# EAGLE board A20-OLinuXino-Lime_Rev_H (EAGLE 4.16), part 1 of 5
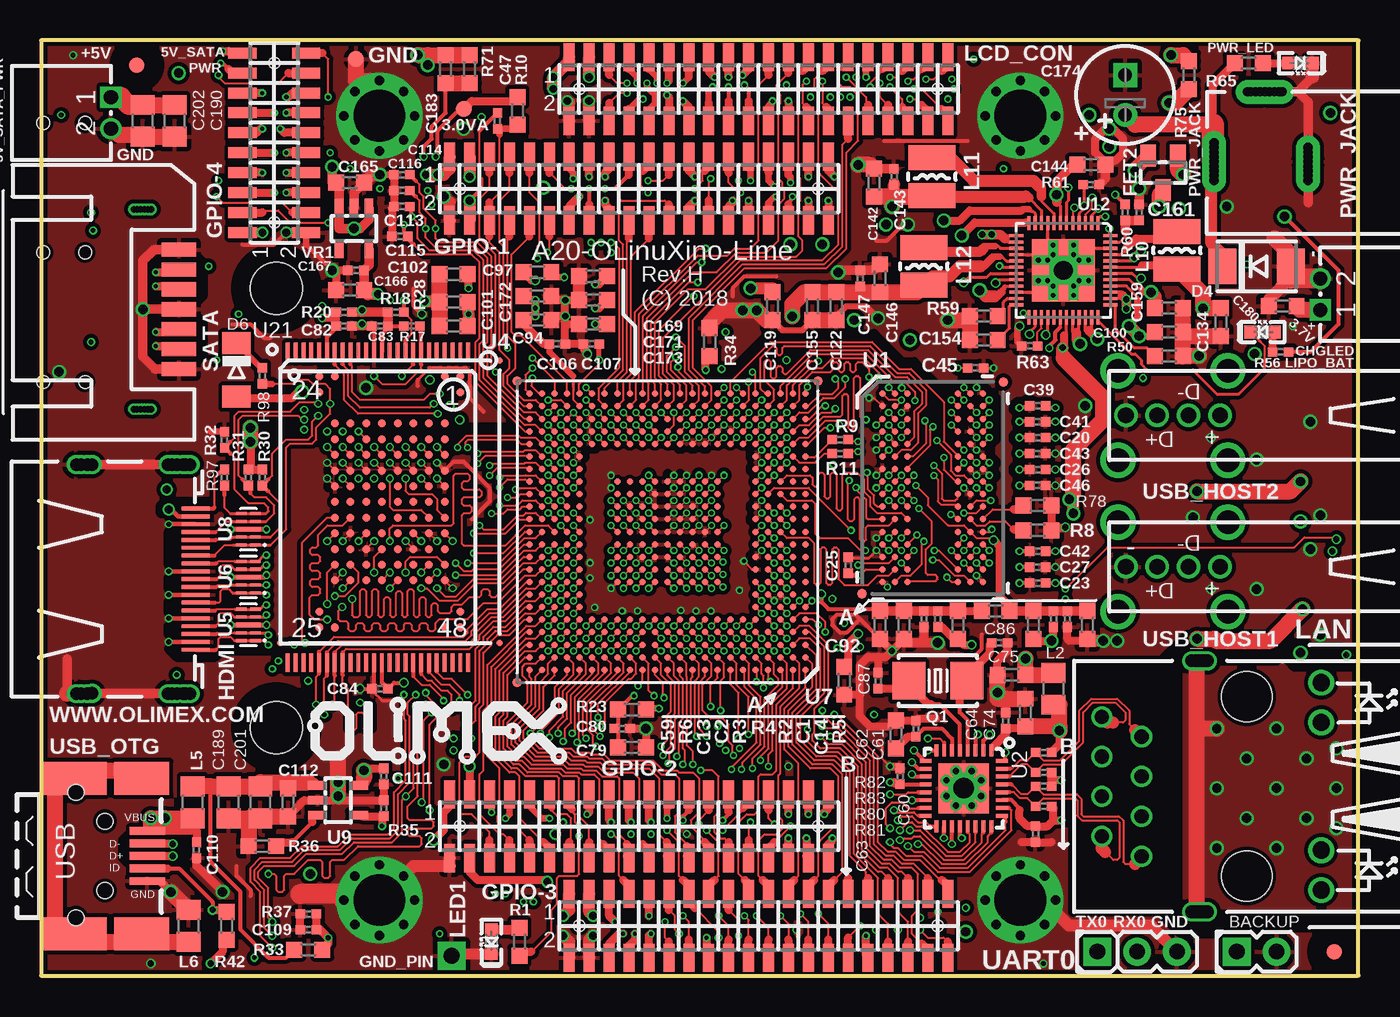
[diagram p5: board, top side]
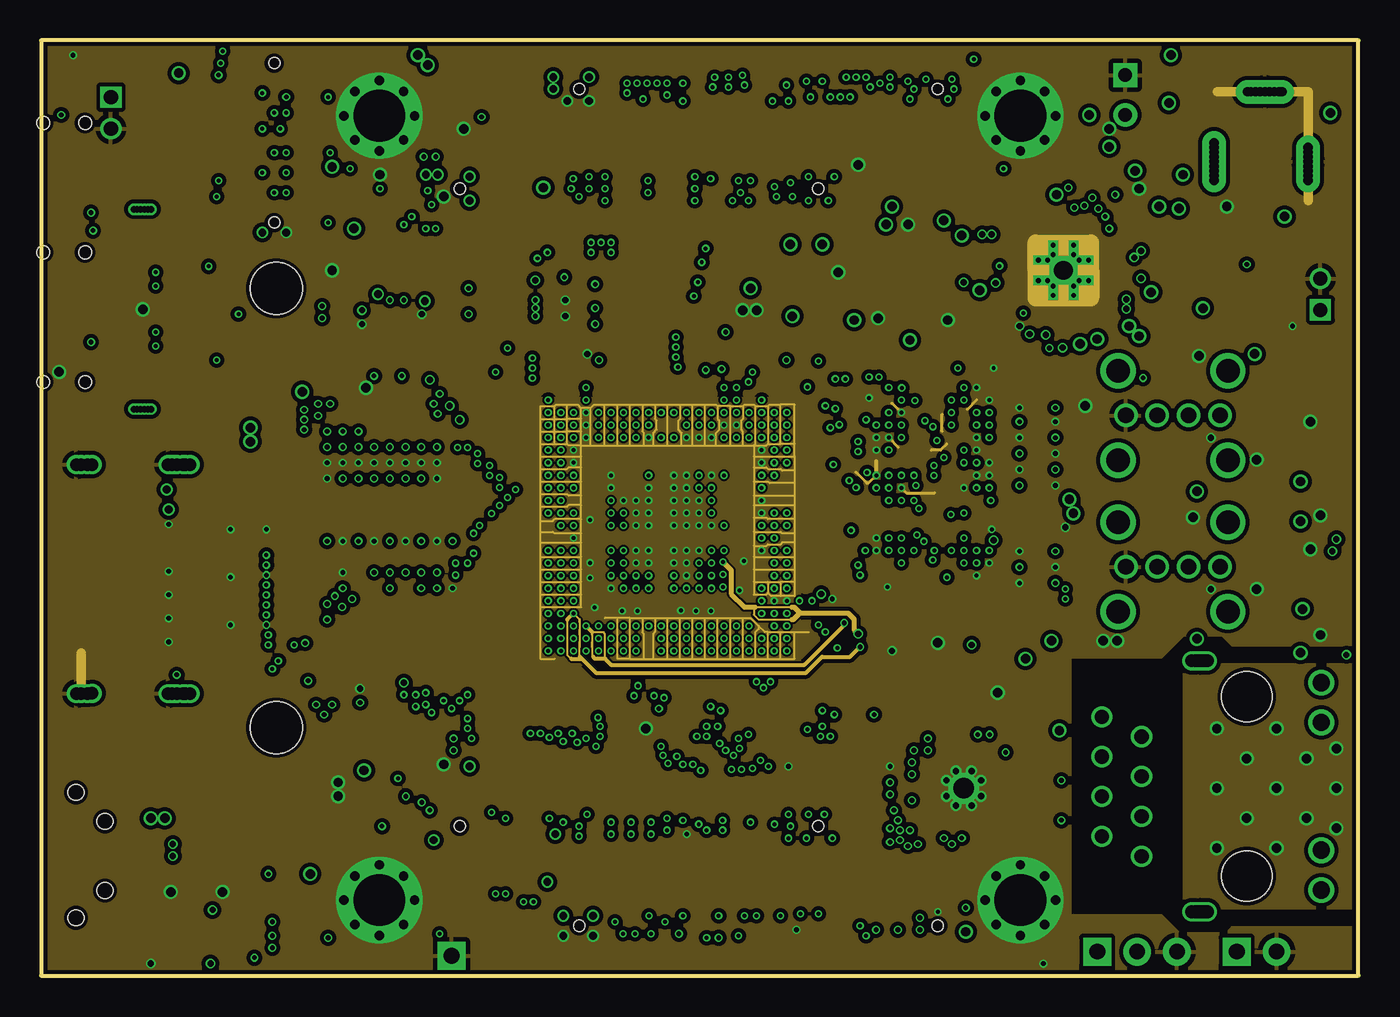
[diagram p6: board, inner layer GND]
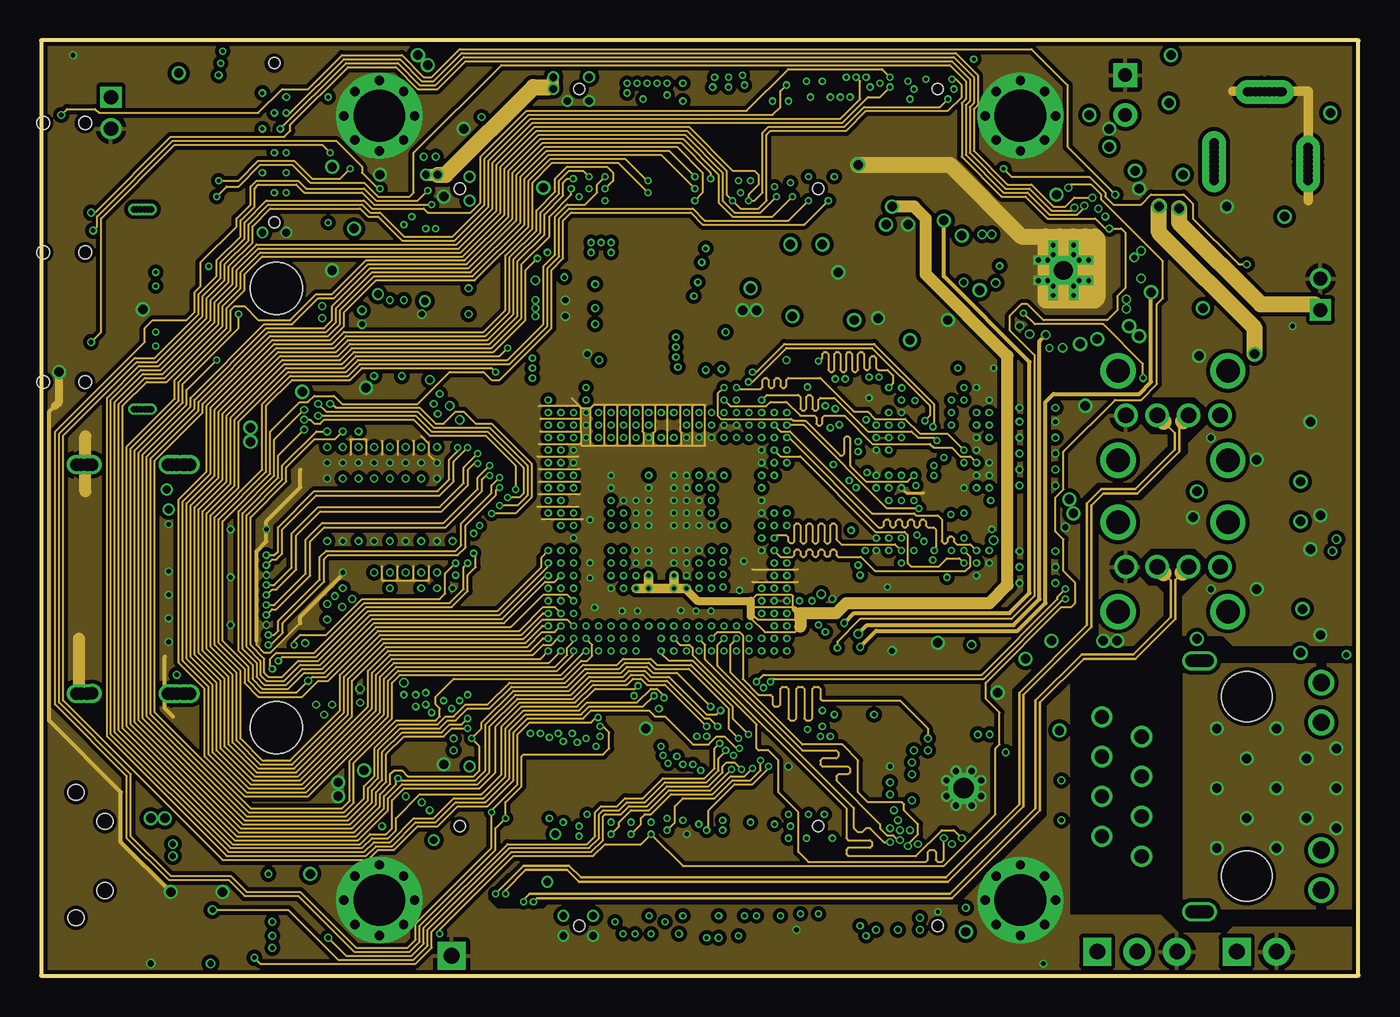
[diagram p7: board, inner layer Route3]
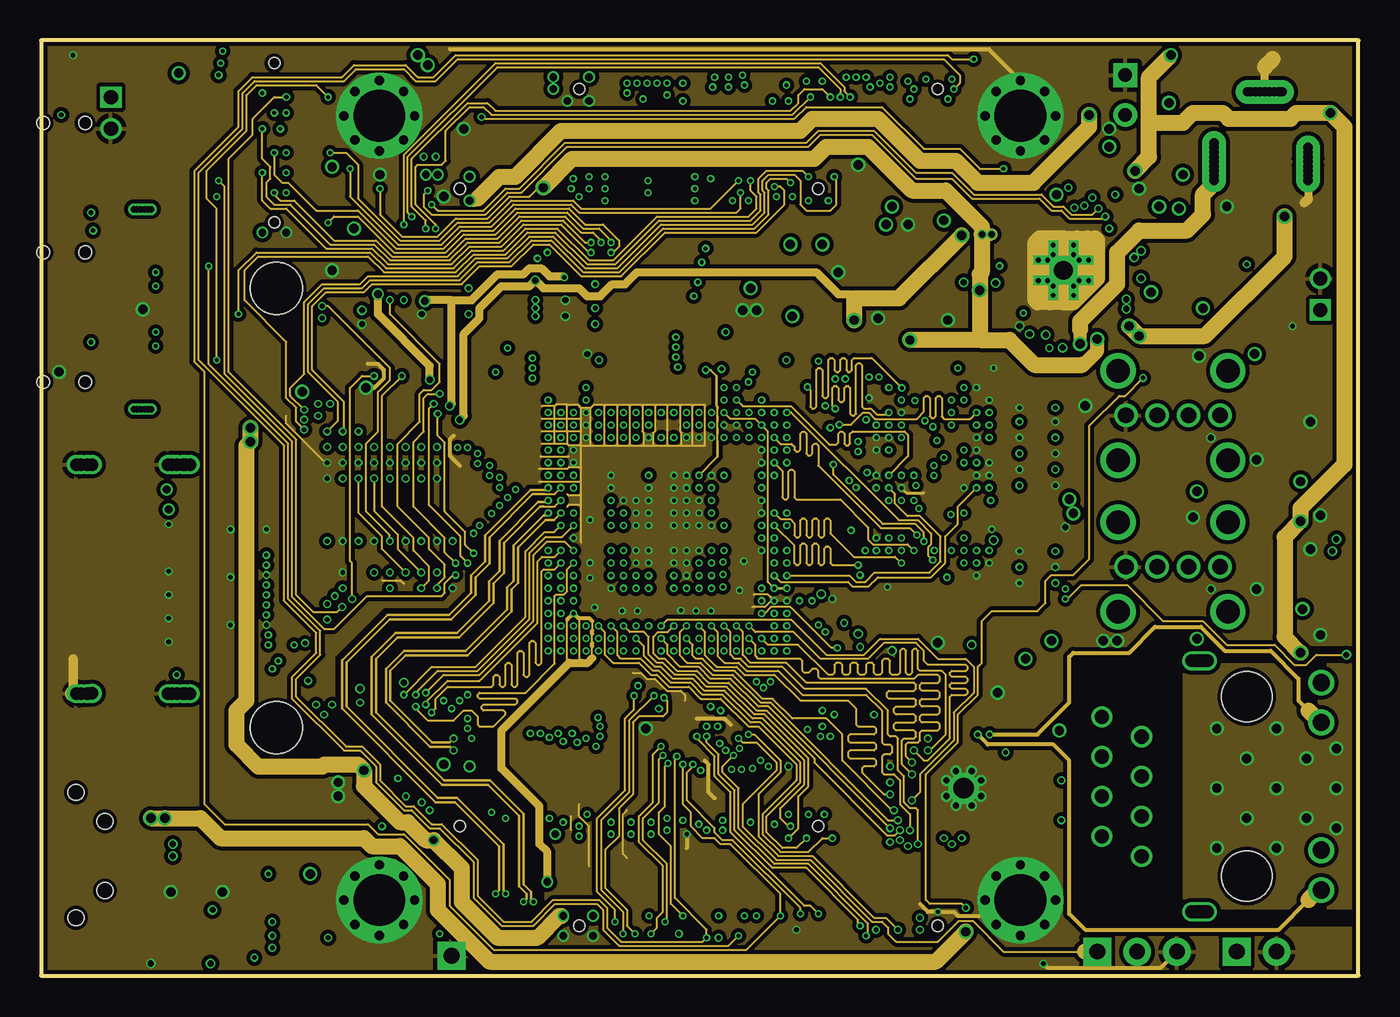
[diagram p8: board, inner layer Route14]
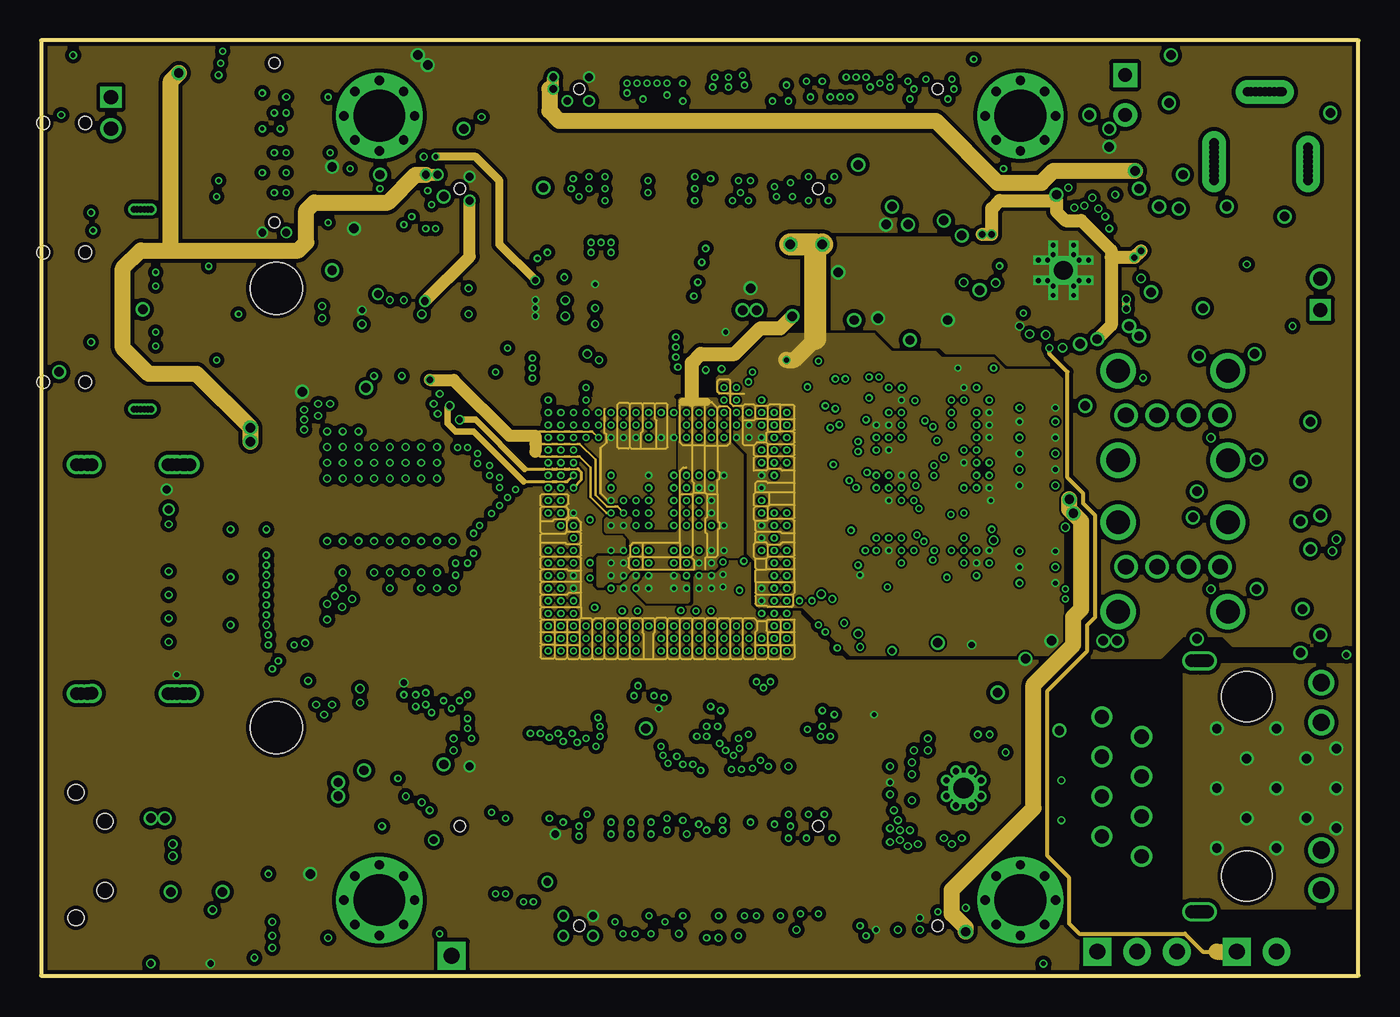
[diagram p9: board, inner layer PWR]
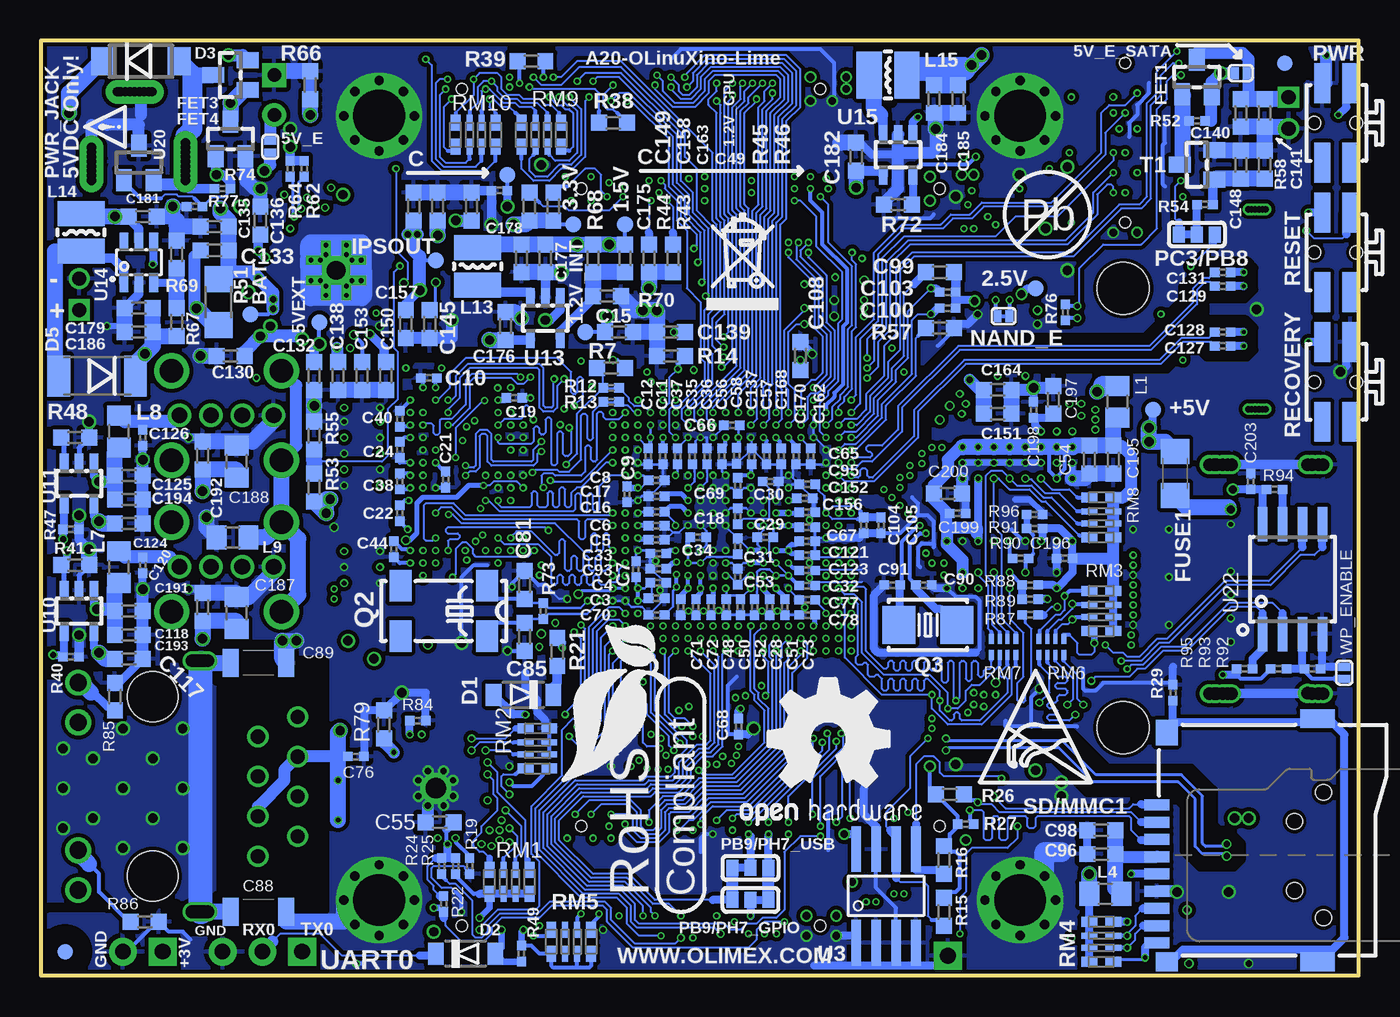
[diagram p10: board, bottom side, seen from below]

Size 83.96 x 59.61 mm. Coordinates in mm from the lower left corner, seen from the top.
Copper layers (1+2*3+14*15+16): Top 0.035mm / dielectric 0.127mm / GND 0.035mm / dielectric 0.5mm / Route3 0.035mm / dielectric 0.2mm / Route14 0.035mm / dielectric 0.5mm / PWR 0.035mm / dielectric 0.127mm / Bottom 0.035mm
Design rules "default": minimum track width 4.5mil, minimum drill 10mil, track to track 5mil, track to pad 5mil, pad to pad 5mil, via to via 5mil, smd to smd 1mil, copper to edge 10mil, drill to drill 8mil, minimum pad ring 6mil, minimum via ring 4mil, stop-mask expansion 4mil, vias tented up to drill 25mil, thermal gap 12mil
tRestrict: 202 lines
bRestrict: 184 lines

## Footprints (pad centres in the part's own frame; a part is rotated, then mirrored left to right if it is on the bottom)
TESTPAD_40-ROUND = smd 1.016 x 1.016: 1 0,0
SJ_1_SMALLER = smd 0.508 x 0.762: 1 -0.381,0; 2 0.381,0
DW02R = drill 0.9 square: 1 -1,0 | drill 0.9 round: 2 1,0
HN1X2 = drill 1 pad 1.778 square: 1 -1.27,0 | drill 1 pad 1.778 round: 2 1.27,0
C0402_TI = smd 0.61 x 0.584: 1 -0.508,0; 2 0.508,0
C0603_DWS = smd 1.016 x 1.016: 1 -0.889,0; 2 0.889,0
C1206_5MILS_WS_ISO = smd 1.016 x 1.778: 1 -1.778,0; 2 1.778,0
E2,5-6,3 = drill 0.864 pad 1.524 round: + -1.27,0 | drill 0.864 pad 1.524 square: - 1.27,0
C0805_5MIL_D = smd 1.27 x 1.524: 1 -1.016,0; 2 1.016,0
HAMMOND_1593LBK_A10_LIME_NO_MILLING = drill 3.3 pad 5.5 round: GND1 21.55,4.81; GND10 62.41,4.81; GND19 21.55,54.81; GND28 62.41,54.81 | drill 0.6 pad 0.9 round: GND2 21.55,7.06; GND3 21.55,2.56; GND4 23.8,4.81; GND5 19.3,4.81; GND6 20.003,6.357; GND7 23.097,3.263; GND8 20.003,3.263; GND9 23.097,6.357; GND11 62.41,7.06; GND12 62.41,2.56; GND13 64.66,4.81; GND14 60.16,4.81; GND15 60.863,6.357; GND16 63.957,3.263; GND17 60.863,3.263; GND18 63.957,6.357; GND20 21.55,57.06; GND21 21.55,52.56; GND22 23.8,54.81; GND23 19.3,54.81; GND24 20.003,56.357; GND25 23.097,53.263; GND26 20.003,53.263; GND27 23.097,56.357; GND29 62.41,57.06; GND30 62.41,52.56; GND31 64.66,54.81; GND32 60.16,54.81; GND33 60.863,56.357; GND34 63.957,53.263; GND35 60.863,53.263; GND36 63.957,56.357 | hole 3.3: 14.98,15.81; 14.98,43.81
LED-0603_TEST = smd 0.8 x 0.8: A 0.762,0; C -0.762,0
SOD-123 = smd 1 x 1.4: A 1.9,0; C -1.9,0
MLL-41 = smd 1.45 x 1.8: A 2.445,0; K -2.445,0
DO214AA = smd 1.778 x 2.286: A 2.177,0; C -2.177,0
MELF-MLL41 = smd 1.45 x 2.6: 1 -2.445,0; 2 2.445,0
MINI-MELF = smd 1.4 x 1.8: A 1.7,0; C -1.7,0
SOT23 = smd 1.4 x 1: 1 1.1,-0.95; 2 1.1,0.95; 3 -1.1,0
1206 = smd 1.6 x 1.8: 1 -1.4,0; 2 1.4,0
TEST_PAD40/70/SQUARE = drill 1.016 pad 1.778 square: P$1 0,0
YA-V36P-2X20-LF = smd 0.7 x 1.8: 1 -12.065,2.032; 2 -12.065,-2.032; 3 -10.795,2.032; 4 -10.795,-2.032; 5 -9.525,2.032; 6 -9.525,-2.032; 7 -8.255,2.032; 8 -8.255,-2.032; 9 -6.985,2.032; 10 -6.985,-2.032; 11 -5.715,2.032; 12 -5.715,-2.032; 13 -4.445,2.032; 14 -4.445,-2.032; 15 -3.175,2.032; 16 -3.175,-2.032; 17 -1.905,2.032; 18 -1.905,-2.032; 19 -0.635,2.032; 20 -0.635,-2.032; 21 0.635,2.032; 22 0.635,-2.032; 23 1.905,2.032; 24 1.905,-2.032; 25 3.175,2.032; 26 3.175,-2.032; 27 4.445,2.032; 28 4.445,-2.032; 29 5.715,2.032; 30 5.715,-2.032; 31 6.985,2.032; 32 6.985,-2.032; 33 8.255,2.032; 34 8.255,-2.032; 35 9.525,2.032; 36 9.525,-2.032; 37 10.795,2.032; 38 10.795,-2.032; 39 12.065,2.032; 40 12.065,-2.032 | hole 0.7: -11.43,0; 11.43,0
YA-V36P-2X10-LF = smd 0.7 x 1.8: 1 -5.715,2.032; 2 -5.715,-2.032; 3 -4.445,2.032; 4 -4.445,-2.032; 5 -3.175,2.032; 6 -3.175,-2.032; 7 -1.905,2.032; 8 -1.905,-2.032; 9 -0.635,2.032; 10 -0.635,-2.032; 11 0.635,2.032; 12 0.635,-2.032; 13 1.905,2.032; 14 1.905,-2.032; 15 3.175,2.032; 16 3.175,-2.032; 17 4.445,2.032; 18 4.445,-2.032; 19 5.715,2.032; 20 5.715,-2.032 | hole 0.7: -5.08,0; 5.08,0
HDMI-SWM-19 = smd 0.25 x 1.8: 1 -4.5,-5.65; 2 -4,-5.65; 3 -3.5,-5.65; 4 -3,-5.65; 5 -2.5,-5.65; 6 -2,-5.65; 7 -1.5,-5.65; 8 -1,-5.65; 9 -0.5,-5.65; 10 0,-5.65; 11 0.5,-5.65; 12 1,-5.65; 13 1.5,-5.65; 14 2,-5.65; 15 2.5,-5.65; 16 3,-5.65; 17 3.5,-5.65; 18 4,-5.65; 19 4.5,-5.65 | drill 0.8 round: P$5 -7.3,-4.85; P$7 -7.3,1.25; P$9 7.3,1.25; P$11 7.3,-4.85; P$13 -7.3,-4.45; P$15 -7.3,1.65; P$18 7.3,1.65; P$20 7.3,-4.45; P$21 -7.3,-4.15; P$22 -7.3,-5; P$23 7.3,-5; P$24 7.3,-4.15; P$25 -7.3,-5.3; P$26 7.3,-5.3; P$27 7.3,0.95; P$28 -7.275,0.95; SH1 -7.3,-3.9; SH2 -7.3,1.95; SH3 7.3,1.95; SH4 7.3,-3.9
L0805_5MIL_DWS = smd 1.27 x 1.524: 1 -1.016,0; 2 1.016,0
CD32 = smd 1.6 x 3: 1 -1.2,0; 2 1.2,0
RJLBC-060TC1_MILLING = drill 0.9 round: 1 -4.455,6.7; 2 -3.185,9.24; 3 -1.915,6.7; 4 -0.645,9.24; 5 0.625,6.7; 6 1.895,9.24; 7 3.165,6.7; 8 4.435,9.24 | drill 0.8 round: _1 -8,2.5; _2 -8,2.7; _3 -8,2.9; _4 -8,3.3; _5 -8,3.5; _6 8,3.5; _7 8,3.3; _8 8,2.9; _9 8,2.7; _10 8,2.5; GND1 -8,3.1; GND2 8,3.1 | drill 1.1 round: AG 4.07,-4.748; AY -6.61,-4.748; KG 6.61,-4.748; KY -4.07,-4.748 | hole 3.2: -5.715,0; 5.715,0
SJ_1_SMALLER_CLOSE_10MILS = smd 0.508 x 0.762: 1 -0.381,0; 2 0.381,0
SJ_2_SMALL_23_TIED = smd 0.762 x 1.016: 1 -1.143,0; 2 0,0; 3 1.143,0
SW_TAKT3X4 = smd 2.54 x 1.016: 1_1 2.54,-0.889; 1_2 -2.54,-0.889; 2_1 2.54,0.889; 2_2 -2.54,0.889 | hole 0.8: 0,1.397; 0,-1.27
PWR_JACK_UNI_MILLING = drill 0.6 pad 1.5 round: + -0.196,4.75; +1 -0.196,5.05; +2 -0.196,5.35; +3 -0.196,5.65; +4 -0.196,4.45; +5 -0.196,4.15; +6 -0.196,3.85; +7 -0.196,3.55; +8 -0.196,5.95; - -6.196,4.75; -1 -6.196,5.05; -2 -6.196,5.35; -3 -6.196,4.45; -4 -6.196,4.15; -5 -6.196,5.65; -6 -6.196,3.85; -8 -6.196,5.95; -- -3.446,0.3; --1 -3.746,0.3; --2 -4.046,0.3; --3 -4.346,0.3; --4 -3.146,0.3; --5 -2.846,0.3; --6 -2.546,0.3; --14 -4.546,0.3; --15 -2.346,0.3
HCX-4S_TEST = smd 2.1 x 2.4: 1 -1.85,0; 2 1.85,0
MC-306_TEST = smd 1.4 x 2: 1 -2.75,-1.6; 2 2.75,-1.6; 3 2.75,1.6; 4 -2.75,1.6
R0603_5MIL_DWS = smd 1.016 x 1.016: 1 -0.889,0; 2 0.889,0
R0402_TI = smd 0.61 x 0.584: 1 -0.508,0; 2 0.508,0
R0402_TI_0R = smd 0.61 x 0.584: 1 -0.508,0; 2 0.508,0
R1206_5MIL_WS = smd 1.651 x 1.778: 1 -1.46,0; 2 1.46,0
0603_0R = smd 1.016 x 1.016: 1 -0.889,0; 2 0.889,0
R_MATRIX_4 = smd 0.635 x 1.016: 1.1 -1.27,-0.762; 1.2 -1.27,0.762; 4.1 1.27,-0.762; 4.2 1.27,0.762 | smd 0.381 x 1.016: 2.1 -0.381,-0.762; 2.2 -0.381,0.762; 3.1 0.381,-0.762; 3.2 0.381,0.762
R_MATRIX_4_0402_25X625_BIGGEROUTPADS = smd 0.325 x 0.625: 1.1 -0.79,-0.512; 1.2 -0.79,0.512; 4.1 0.79,-0.512; 4.2 0.79,0.512 | smd 0.25 x 0.625: 2.1 -0.25,-0.512; 2.2 -0.25,0.512; 3.1 0.25,-0.512; 3.2 0.25,0.512
SATA-PWA-07 = smd 0.9 x 2.2: 1 -4.25,-4.8; 2 -2.98,-4.8; 3 -1.71,-4.8; 4 -0.44,-4.8; 5 0.83,-4.8; 6 2.1,-4.8; 7 3.37,-4.8 | drill 0.4 round: P$1 -6.81,-2.35; P$2 -6.81,-2.125; P$3 -6.81,-2.6; P$4 -6.81,-1.925; P$5 -6.81,-3.025; P$11 5.93,-2.35; P$20 5.93,-2.125; P$23 5.93,-2.6; P$24 5.93,-1.925; P$26 5.93,-3.025; SH1 -6.81,-2.825; SH4 5.93,-2.825
TFC-WPAPR-08 = smd 1.6 x 0.7: 1 -6.994,2.25; 2 -6.994,1.15; 3 -6.994,0.05; 4 -6.994,-1.05; 5 -6.994,-2.15; 6 -6.994,-3.25; 7 -6.994,-4.35; 8 -6.994,-5.45; 9 -6.994,-6.55 | smd 1.4 x 1.2: 10 -6.369,-7.75 | smd 1.4 x 1.6: 11 -6.369,6.85 | smd 2.2 x 1.2: 12 3.231,-7.75; 13 3.231,7.75 | hole 1: 3.631,-4.95; 3.631,3.05
FBGA96_MEM = smd 0.4 x 0.4: A1 -6,-3.2; A2 -6,-2.4; A3 -6,-1.6; A7 -6,1.6; A8 -6,2.4; A9 -6,3.2; B1 -5.2,-3.2; B2 -5.2,-2.4; B3 -5.2,-1.6; B7 -5.2,1.6; B8 -5.2,2.4; B9 -5.2,3.2; C1 -4.4,-3.2; C2 -4.4,-2.4; C3 -4.4,-1.6; C7 -4.4,1.6; C8 -4.4,2.4; C9 -4.4,3.2; D1 -3.6,-3.2; D2 -3.6,-2.4; D3 -3.6,-1.6; D7 -3.6,1.6; D8 -3.6,2.4; D9 -3.6,3.2; E1 -2.8,-3.2; E2 -2.8,-2.4; E3 -2.8,-1.6; E7 -2.8,1.6; E8 -2.8,2.4; E9 -2.8,3.2; F1 -2,-3.2; F2 -2,-2.4; F3 -2,-1.6; F7 -2,1.6; F8 -2,2.4; F9 -2,3.2; G1 -1.2,-3.2; G2 -1.2,-2.4; G3 -1.2,-1.6; G7 -1.2,1.6; G8 -1.2,2.4; G9 -1.2,3.2; H1 -0.4,-3.2; H2 -0.4,-2.4; H3 -0.4,-1.6; H7 -0.4,1.6; H8 -0.4,2.4; H9 -0.4,3.2; J1 0.4,-3.2; J2 0.4,-2.4; J3 0.4,-1.6; J7 0.4,1.6; J8 0.4,2.4; J9 0.4,3.2; K1 1.2,-3.2; K2 1.2,-2.4; K3 1.2,-1.6; K7 1.2,1.6; K8 1.2,2.4; K9 1.2,3.2; L1 2,-3.2; L2 2,-2.4; L3 2,-1.6; L7 2,1.6; L8 2,2.4; L9 2,3.2; M1 2.8,-3.2; M2 2.8,-2.4; M3 2.8,-1.6; M7 2.8,1.6; M8 2.8,2.4; M9 2.8,3.2; N1 3.6,-3.2; N2 3.6,-2.4; N3 3.6,-1.6; N7 3.6,1.6; N8 3.6,2.4; N9 3.6,3.2; P1 4.4,-3.2; P2 4.4,-2.4; P3 4.4,-1.6; P7 4.4,1.6; P8 4.4,2.4; P9 4.4,3.2; R1 5.2,-3.2; R2 5.2,-2.4; R3 5.2,-1.6; R7 5.2,1.6; R8 5.2,2.4; R9 5.2,3.2; T1 6,-3.2; T2 6,-2.4; T3 6,-1.6; T7 6,1.6; T8 6,2.4; T9 6,3.2 | smd 0.6 x 0.6: FID1 6.75,-4.5; FID2 -6.75,4.5
QFN-32(DRILLS) = smd 0.25 x 0.75: 1 -1.75,-2.425; 2 -1.25,-2.425; 3 -0.75,-2.425; 4 -0.25,-2.425; 5 0.25,-2.425; 6 0.75,-2.425; 7 1.25,-2.425; 8 1.75,-2.425; 17 1.75,2.425; 18 1.25,2.425; 19 0.75,2.425; 20 0.25,2.425; 21 -0.25,2.425; 22 -0.75,2.425; 23 -1.25,2.425; 24 -1.75,2.425 | smd 0.75 x 0.25: 9 2.425,-1.75; 10 2.425,-1.25; 11 2.425,-0.75; 12 2.425,-0.25; 13 2.425,0.25; 14 2.425,0.75; 15 2.425,1.25; 16 2.425,1.75; 25 -2.425,1.75; 26 -2.425,1.25; 27 -2.425,0.75; 28 -2.425,0.25; 29 -2.425,-0.25; 30 -2.425,-0.75; 31 -2.425,-1.25; 32 -2.425,-1.75 | drill 1.3 round: EP1 0,0 | drill 0.4 round: EP2 -0.5,1.1; EP3 0.5,1.1; EP4 1.1,0.5; EP5 1.1,-0.5; EP6 0.5,-1.1; EP7 -0.5,-1.1; EP8 -1.1,-0.5; EP9 -1.1,0.5 | smd 3.2 x 3.2: EXP_PAD 0,0
SO-08MN = smd 0.61 x 2.921: 1 -1.905,-2.981; 2 -0.635,-2.981; 3 0.635,-2.981; 4 1.905,-2.981; 5 1.905,2.981; 6 0.635,2.981; 7 -0.635,2.981; 8 -1.905,2.981
TSOP48 = smd 1.2 x 0.25: 1 -9.9,5.75; 2 -9.9,5.25; 3 -9.9,4.75; 4 -9.9,4.25; 5 -9.9,3.75; 6 -9.9,3.25; 7 -9.9,2.75; 8 -9.9,2.25; 9 -9.9,1.75; 10 -9.9,1.25; 11 -9.9,0.75; 12 -9.9,0.25; 13 -9.9,-0.25; 14 -9.9,-0.75; 15 -9.9,-1.25; 16 -9.9,-1.75; 17 -9.9,-2.25; 18 -9.9,-2.75; 19 -9.9,-3.25; 20 -9.9,-3.75; 21 -9.9,-4.25; 22 -9.9,-4.75; 23 -9.9,-5.25; 24 -9.9,-5.75; 25 9.9,-5.75; 26 9.9,-5.25; 27 9.9,-4.75; 28 9.9,-4.25; 29 9.9,-3.75; 30 9.9,-3.25; 31 9.9,-2.75; 32 9.9,-2.25; 33 9.9,-1.75; 34 9.9,-1.25; 35 9.9,-0.75; 36 9.9,-0.25; 37 9.9,0.25; 38 9.9,0.75; 39 9.9,1.25; 40 9.9,1.75; 41 9.9,2.25; 42 9.9,2.75; 43 9.9,3.25; 44 9.9,3.75; 45 9.9,4.25; 46 9.9,4.75; 47 9.9,5.25; 48 9.9,5.75
SLP2510P8_TEST = smd 0.2 x 0.675: 1 -1,-0.438; 2 -0.5,-0.438; 4 0.5,-0.438; 5 1,-0.438; 6 1,0.438; 7 0.5,0.438; 9 -0.5,0.438; 10 -1,0.438 | smd 0.3 x 0.775: 3 0,-0.388; 8 0,0.388
TFBGA441 = smd 0.4 x 0.4: A1 -8.8,-8.8; A2 -8.8,-8; A3 -8.8,-7.2; A4 -8.8,-6.4; A5 -8.8,-5.6; A6 -8.8,-4.8; A7 -8.8,-4; A8 -8.8,-3.2; A9 -8.8,-2.4; A10 -8.8,-1.6; A11 -8.8,-0.8; A12 -8.8,0; A13 -8.8,0.8; A14 -8.8,1.6; A15 -8.8,2.4; A16 -8.8,3.2; A17 -8.8,4; A18 -8.8,4.8; A19 -8.8,5.6; A20 -8.8,6.4; A21 -8.8,7.2; A22 -8.8,8; A23 -8.8,8.8; AA1 7.2,-8.8; AA2 7.2,-8; AA3 7.2,-7.2; AA4 7.2,-6.4; AA5 7.2,-5.6; AA6 7.2,-4.8; AA7 7.2,-4; AA8 7.2,-3.2; AA9 7.2,-2.4; AA10 7.2,-1.6; AA11 7.2,-0.8; AA12 7.2,0; AA13 7.2,0.8; AA14 7.2,1.6; AA15 7.2,2.4; AA16 7.2,3.2; AA17 7.2,4; AA18 7.2,4.8; AA19 7.2,5.6; AA20 7.2,6.4; AA21 7.2,7.2; AA22 7.2,8; AA23 7.2,8.8; AB1 8,-8.8; AB2 8,-8; AB3 8,-7.2; AB4 8,-6.4; AB5 8,-5.6; AB6 8,-4.8; AB7 8,-4; AB8 8,-3.2; AB9 8,-2.4; AB10 8,-1.6; AB11 8,-0.8; AB12 8,0; AB13 8,0.8; AB14 8,1.6; AB15 8,2.4; AB16 8,3.2; AB17 8,4; AB18 8,4.8; AB19 8,5.6; AB20 8,6.4; AB21 8,7.2; AB22 8,8; AB23 8,8.8; AC1 8.8,-8.8; AC2 8.8,-8; AC3 8.8,-7.2; AC4 8.8,-6.4; AC5 8.8,-5.6; AC6 8.8,-4.8; AC7 8.8,-4; AC8 8.8,-3.2; AC9 8.8,-2.4; AC10 8.8,-1.6; AC11 8.8,-0.8; AC12 8.8,0; AC13 8.8,0.8; AC14 8.8,1.6; AC15 8.8,2.4; AC16 8.8,3.2; AC17 8.8,4; AC18 8.8,4.8; AC19 8.8,5.6; AC20 8.8,6.4; AC21 8.8,7.2; AC22 8.8,8; AC23 8.8,8.8; B1 -8,-8.8; B2 -8,-8; B3 -8,-7.2; B4 -8,-6.4; B5 -8,-5.6; B6 -8,-4.8; B7 -8,-4; B8 -8,-3.2; B9 -8,-2.4; B10 -8,-1.6; B11 -8,-0.8; B12 -8,0; B13 -8,0.8; B14 -8,1.6; B15 -8,2.4; B16 -8,3.2; B17 -8,4; B18 -8,4.8; B19 -8,5.6; B20 -8,6.4; B21 -8,7.2; B22 -8,8; B23 -8,8.8; C1 -7.2,-8.8; C2 -7.2,-8; C3 -7.2,-7.2; C4 -7.2,-6.4; C5 -7.2,-5.6; C6 -7.2,-4.8; C7 -7.2,-4; C8 -7.2,-3.2; C9 -7.2,-2.4; C10 -7.2,-1.6; C11 -7.2,-0.8; C12 -7.2,0; C13 -7.2,0.8; C14 -7.2,1.6; C15 -7.2,2.4; C16 -7.2,3.2; C17 -7.2,4; C18 -7.2,4.8; C19 -7.2,5.6; C20 -7.2,6.4; C21 -7.2,7.2; C22 -7.2,8; C23 -7.2,8.8; D1 -6.4,-8.8; D2 -6.4,-8; D3 -6.4,-7.2; D4 -6.4,-6.4; D5 -6.4,-5.6; D6 -6.4,-4.8; D7 -6.4,-4; D8 -6.4,-3.2; D9 -6.4,-2.4; D10 -6.4,-1.6; D11 -6.4,-0.8; D12 -6.4,0; D13 -6.4,0.8; D14 -6.4,1.6; D15 -6.4,2.4; D16 -6.4,3.2; D17 -6.4,4; D18 -6.4,4.8; D19 -6.4,5.6; D20 -6.4,6.4; D21 -6.4,7.2; D22 -6.4,8; D23 -6.4,8.8; E1 -5.6,-8.8; E2 -5.6,-8; E3 -5.6,-7.2; E4 -5.6,-6.4; E5 -5.6,-5.6; E6 -5.6,-4.8; E7 -5.6,-4; E8 -5.6,-3.2; E9 -5.6,-2.4; E10 -5.6,-1.6; E11 -5.6,-0.8; E12 -5.6,0; E13 -5.6,0.8; E14 -5.6,1.6; E15 -5.6,2.4; E16 -5.6,3.2; E17 -5.6,4; E18 -5.6,4.8; E19 -5.6,5.6; E20 -5.6,6.4; E21 -5.6,7.2; E22 -5.6,8; E23 -5.6,8.8; F1 -4.8,-8.8; F2 -4.8,-8; F3 -4.8,-7.2; F4 -4.8,-6.4; F5 -4.8,-5.6; F19 -4.8,5.6; F20 -4.8,6.4; F21 -4.8,7.2; F22 -4.8,8; F23 -4.8,8.8; G1 -4,-8.8; G2 -4,-8; G3 -4,-7.2; G4 -4,-6.4; G5 -4,-5.6; G19 -4,5.6; G20 -4,6.4; G21 -4,7.2; G22 -4,8; G23 -4,8.8; H1 -3.2,-8.8; H2 -3.2,-8; H3 -3.2,-7.2; H4 -3.2,-6.4; H5 -3.2,-5.6; H8 -3.2,-3.2; H9 -3.2,-2.4; H10 -3.2,-1.6; H11 -3.2,-0.8; H12 -3.2,0; H13 -3.2,0.8; H14 -3.2,1.6; H15 -3.2,2.4; H16 -3.2,3.2; H19 -3.2,5.6; H20 -3.2,6.4; H21 -3.2,7.2; H22 -3.2,8; H23 -3.2,8.8; J1 -2.4,-8.8; J2 -2.4,-8; J3 -2.4,-7.2; J4 -2.4,-6.4; J5 -2.4,-5.6; J8 -2.4,-3.2; J9 -2.4,-2.4; J10 -2.4,-1.6; J11 -2.4,-0.8; J12 -2.4,0; J13 -2.4,0.8; J14 -2.4,1.6; J15 -2.4,2.4; J16 -2.4,3.2; J19 -2.4,5.6; J20 -2.4,6.4; J21 -2.4,7.2; J22 -2.4,8; J23 -2.4,8.8; K1 -1.6,-8.8; K2 -1.6,-8; K3 -1.6,-7.2; K4 -1.6,-6.4; K5 -1.6,-5.6; K8 -1.6,-3.2; K9 -1.6,-2.4; K10 -1.6,-1.6; K11 -1.6,-0.8; K12 -1.6,0; K13 -1.6,0.8; K14 -1.6,1.6; K15 -1.6,2.4; K16 -1.6,3.2; K19 -1.6,5.6; K20 -1.6,6.4; K21 -1.6,7.2; K22 -1.6,8; K23 -1.6,8.8; L1 -0.8,-8.8; L2 -0.8,-8; L3 -0.8,-7.2; L4 -0.8,-6.4; L5 -0.8,-5.6; L8 -0.8,-3.2; L9 -0.8,-2.4; L10 -0.8,-1.6; L11 -0.8,-0.8; L12 -0.8,0; L13 -0.8,0.8; L14 -0.8,1.6; L15 -0.8,2.4; L16 -0.8,3.2; L19 -0.8,5.6; L20 -0.8,6.4; L21 -0.8,7.2; L22 -0.8,8; L23 -0.8,8.8; M1 0,-8.8; M2 0,-8; M3 0,-7.2; M4 0,-6.4; M5 0,-5.6; M8 0,-3.2; M9 0,-2.4; M10 0,-1.6; M11 0,-0.8; M12 0,0; M13 0,0.8; M14 0,1.6; M15 0,2.4; M16 0,3.2; M19 0,5.6; M20 0,6.4; M21 0,7.2; M22 0,8; M23 0,8.8; N1 0.8,-8.8; N2 0.8,-8; N3 0.8,-7.2; N4 0.8,-6.4; N5 0.8,-5.6; N8 0.8,-3.2; N9 0.8,-2.4; N10 0.8,-1.6; N11 0.8,-0.8; N12 0.8,0; N13 0.8,0.8; N14 0.8,1.6; N15 0.8,2.4; N16 0.8,3.2; N19 0.8,5.6; N20 0.8,6.4; N21 0.8,7.2; N22 0.8,8; N23 0.8,8.8; P1 1.6,-8.8; P2 1.6,-8; P3 1.6,-7.2; P4 1.6,-6.4; P5 1.6,-5.6; P8 1.6,-3.2; P9 1.6,-2.4; P10 1.6,-1.6; P11 1.6,-0.8; P12 1.6,0; P13 1.6,0.8; P14 1.6,1.6; P15 1.6,2.4; P16 1.6,3.2; P19 1.6,5.6; P20 1.6,6.4; P21 1.6,7.2; P22 1.6,8; P23 1.6,8.8; R1 2.4,-8.8; R2 2.4,-8; R3 2.4,-7.2; R4 2.4,-6.4; R5 2.4,-5.6; R8 2.4,-3.2; R9 2.4,-2.4; R10 2.4,-1.6; R11 2.4,-0.8; R12 2.4,0; R13 2.4,0.8; R14 2.4,1.6; R15 2.4,2.4; R16 2.4,3.2; R19 2.4,5.6; R20 2.4,6.4; R21 2.4,7.2; R22 2.4,8; R23 2.4,8.8; T1 3.2,-8.8; T2 3.2,-8; T3 3.2,-7.2; T4 3.2,-6.4; T5 3.2,-5.6; T8 3.2,-3.2; T9 3.2,-2.4; T10 3.2,-1.6; T11 3.2,-0.8; T12 3.2,0; T13 3.2,0.8; T14 3.2,1.6; T15 3.2,2.4; T16 3.2,3.2; T19 3.2,5.6; T20 3.2,6.4; T21 3.2,7.2; T22 3.2,8; T23 3.2,8.8; U1 4,-8.8; U2 4,-8; U3 4,-7.2; U4 4,-6.4; U5 4,-5.6; U19 4,5.6; U20 4,6.4; U21 4,7.2; U22 4,8; U23 4,8.8; V1 4.8,-8.8; V2 4.8,-8; V3 4.8,-7.2; V4 4.8,-6.4; V5 4.8,-5.6; V19 4.8,5.6; V20 4.8,6.4; V21 4.8,7.2; V22 4.8,8; V23 4.8,8.8; W1 5.6,-8.8; W2 5.6,-8; W3 5.6,-7.2; W4 5.6,-6.4; W5 5.6,-5.6; W6 5.6,-4.8; W7 5.6,-4; W8 5.6,-3.2; W9 5.6,-2.4; W10 5.6,-1.6; W11 5.6,-0.8; W12 5.6,0; W13 5.6,0.8; W14 5.6,1.6; W15 5.6,2.4; W16 5.6,3.2; W17 5.6,4; W18 5.6,4.8; W19 5.6,5.6; W20 5.6,6.4; W21 5.6,7.2; W22 5.6,8; W23 5.6,8.8; Y1 6.4,-8.8; Y2 6.4,-8; Y3 6.4,-7.2; Y4 6.4,-6.4; Y5 6.4,-5.6; Y6 6.4,-4.8; Y7 6.4,-4; Y8 6.4,-3.2; Y9 6.4,-2.4; Y10 6.4,-1.6; Y11 6.4,-0.8; Y12 6.4,0; Y13 6.4,0.8; Y14 6.4,1.6; Y15 6.4,2.4; Y16 6.4,3.2; Y17 6.4,4; Y18 6.4,4.8; Y19 6.4,5.6; Y20 6.4,6.4; Y21 6.4,7.2; Y22 6.4,8; Y23 6.4,8.8 | smd 0.6 x 0.6: FID1 -9.6,9.6; FID2 9.6,9.6; FID3 9.6,-9.6
SOT23-5 = smd 1.2 x 0.55: 1 1.3,-0.95; 2 1.3,0; 3 1.3,0.95; 4 -1.3,0.95; 5 -1.3,-0.95
QFN48 = smd 0.2 x 0.9: 1 -2.2,-3; 2 -1.8,-3; 3 -1.4,-3; 4 -1,-3; 5 -0.6,-3; 6 -0.2,-3; 7 0.2,-3; 8 0.6,-3; 9 1,-3; 10 1.4,-3; 11 1.8,-3; 12 2.2,-3; 25 2.2,3; 26 1.8,3; 27 1.4,3; 28 1,3; 29 0.6,3; 30 0.2,3; 31 -0.2,3; 32 -0.6,3; 33 -1,3; 34 -1.4,3; 35 -1.8,3; 36 -2.2,3 | smd 0.9 x 0.2: 13 3,-2.2; 14 3,-1.8; 15 3,-1.4; 16 3,-1; 17 3,-0.6; 18 3,-0.2; 19 3,0.2; 20 3,0.6; 21 3,1; 22 3,1.4; 23 3,1.8; 24 3,2.2; 37 -3,2.2; 38 -3,1.8; 39 -3,1.4; 40 -3,1; 41 -3,0.6; 42 -3,0.2; 43 -3,-0.2; 44 -3,-0.6; 45 -3,-1; 46 -3,-1.4; 47 -3,-1.8; 48 -3,-2.2 | drill 1.2 pad 1.422 square: N1 0,0 | drill 0.3 pad 0.4 square: N2 -1.6,0.65; N3 -1,0.65; N4 -1.6,-0.65; N5 -1,-0.65; N6 -0.65,-1.6; N7 -0.65,-1; N8 0.65,-1.6; N9 0.65,-1; N10 1.6,-0.65; N11 1,-0.65; N12 1.6,0.65; N13 1,0.65; N14 0.65,1.6; N15 0.65,1; N16 -0.65,1.6; N17 -0.65,1 | smd 4 x 4: VSS 0,0
SOT23-6 = smd 1.2 x 0.55: 1 1.3,-0.95; 2 1.3,0; 3 1.3,0.95; 4 -1.3,0.95; 5 -1.3,0; 6 -1.3,-0.95
FIDUCIAL-1X3 = smd 1 x 1: 1 0,0
TBGA100 = smd 0.5 x 0.5: A1 -8,-4.5; A2 -8,-3.5; A9 -8,3.5; A10 -8,4.5; B1 -7,-4.5; B10 -7,4.5; D2 -5,-3.5; D3 -5,-2.5; D4 -5,-1.5; D5 -5,-0.5; D6 -5,0.5; D7 -5,1.5; D8 -5,2.5; D9 -5,3.5; E2 -4,-3.5; E3 -4,-2.5; E4 -4,-1.5; E5 -4,-0.5; E6 -4,0.5; E7 -4,1.5; E8 -4,2.5; E9 -4,3.5; F2 -3,-3.5; F3 -3,-2.5; F4 -3,-1.5; F5 -3,-0.5; F6 -3,0.5; F7 -3,1.5; F8 -3,2.5; F9 -3,3.5; G2 -2,-3.5; G3 -2,-2.5; G4 -2,-1.5; G5 -2,-0.5; G6 -2,0.5; G7 -2,1.5; G8 -2,2.5; G9 -2,3.5; H2 -1,-3.5; H3 -1,-2.5; H4 -1,-1.5; H5 -1,-0.5; H6 -1,0.5; H7 -1,1.5; H8 -1,2.5; H9 -1,3.5; J2 0,-3.5; J3 0,-2.5; J4 0,-1.5; J5 0,-0.5; J6 0,0.5; J7 0,1.5; J8 0,2.5; J9 0,3.5; K2 1,-3.5; K3 1,-2.5; K4 1,-1.5; K5 1,-0.5; K6 1,0.5; K7 1,1.5; K8 1,2.5; K9 1,3.5; L2 2,-3.5; L3 2,-2.5; L4 2,-1.5; L5 2,-0.5; L6 2,0.5; L7 2,1.5; L8 2,2.5; L9 2,3.5; M2 3,-3.5; M3 3,-2.5; M4 3,-1.5; M5 3,-0.5; M6 3,0.5; M7 3,1.5; M8 3,2.5; M9 3,3.5; N2 4,-3.5; N3 4,-2.5; N4 4,-1.5; N5 4,-0.5; N6 4,0.5; N7 4,1.5; N8 4,2.5; N9 4,3.5; P2 5,-3.5; P3 5,-2.5; P4 5,-1.5; P5 5,-0.5; P6 5,0.5; P7 5,1.5; P8 5,2.5; P9 5,3.5; T1 7,-4.5; T10 7,4.5; U1 8,-4.5; U2 8,-3.5; U9 8,3.5; U10 8,4.5 | smd 0.4 x 0.4: FID1 9,-7; FID2 9,7; FID3 -9,7
SO-8-BIG = smd 0.6 x 2.2: 1 -1.905,-3.5; 2 -0.635,-3.5; 3 0.635,-3.5; 4 1.905,-3.5; 5 1.905,3.5; 6 0.635,3.5; 7 -0.635,3.5; 8 -1.905,3.5
HN1X3 = drill 1 pad 1.778 square: 1 -2.54,0 | drill 1 pad 1.778 round: 2 0,0; 3 2.54,0
USB_A_VERTICAL_PTH = drill 1 round: 1 3.45,12.75; 2 3.45,14.75; 3 3.45,16.75; 4 3.45,18.75 | drill 1.5 round: P$1 0.6,12.25; P$2 6.3,12.25; P$3 6.3,19.25; P$4 0.6,19.25
USB_MINI_9PIN = smd 2.25 x 0.5: D+ -3.722,0; D- -3.722,-0.8; GND -3.722,1.6; ID -3.722,0.8; VBUS -3.722,-1.6 | smd 4 x 2.1: GND1 0.884,-4.95; GND3 0.884,4.95 | smd 3.5 x 2.1: GND2 -3.366,-4.95; GND4 -3.366,4.95 | hole 1: -1.016,-2.2; -1.016,2.2
SOT-23-5 = smd 1.2 x 0.55: 1 1.3,-0.95; 2 1.3,0; 3 1.3,0.95; 4 -1.3,0.95; 5 -1.3,-0.95

## Placement (x,y rotation side)
1.2V_CPU  TESTPADTESTPAD_40-ROUND  [TESTPAD_40-ROUND]  54.23,51.05 0 bottom
1.2V_INT  TESTPADTESTPAD_40-ROUND  [TESTPAD_40-ROUND]  49.28,41.02 0 bottom
1.5V  TESTPADTESTPAD_40-ROUND  [TESTPAD_40-ROUND]  46.74,47.88 0 bottom
2.5V  TESTPADTESTPAD_40-ROUND  [TESTPAD_40-ROUND]  20.57,43.81 0 bottom
3.0VA  TESTPADTESTPAD_40-ROUND  [TESTPAD_40-ROUND]  26.92,55.25 180 top
3.3V  TESTPADTESTPAD_40-ROUND  [TESTPAD_40-ROUND]  50.04,47.88 0 bottom
5V_E  Open  [SJ_1_SMALLER]  69.34,52.83 270 bottom
5V_E_SATA  Open  [SJ_1_SMALLER]  7.49,57.53 0 bottom
5V_SATA_PWR  DW02R  [DW02R]  4.44,54.99 270 top
5VEXT  TESTPADTESTPAD_40-ROUND  [TESTPAD_40-ROUND]  66.22,41.66 0 bottom
+5V  TESTPADTESTPAD_40-ROUND  [TESTPAD_40-ROUND]  13.08,36.07 0 bottom
BACKUP  NA(HN1X2)  [HN1X2]  77.47,1.52 0 top
BAT  TESTPADTESTPAD_40-ROUND  [TESTPAD_40-ROUND]  70.61,42.16 0 bottom
C1  220nF  [C0402_TI]  64.52,22.73 90 top
C2  220nF  [C0402_TI]  57.15,22.73 90 top
C3  220nF  [C0402_TI]  44.73,24.05 180 bottom
C4  220nF  [C0402_TI]  44.63,25.04 180 bottom
C5  220nF  [C0402_TI]  44.73,27.79 180 bottom
C6  220nF  [C0402_TI]  44.73,28.68 180 bottom
C7  220nF  [C0402_TI]  46.04,25.91 270 bottom
C8  220nF  [C0402_TI]  44.73,31.57 180 bottom
C9  220nF  [C0402_TI]  46.61,30.67 90 bottom
C10  220nF  [C0402_TI]  59.25,38.1 0 bottom
C11  220nF  [C0402_TI]  44.32,33.1 90 bottom
C12  220nF  [C0402_TI]  45.26,33.1 90 bottom
C13  220nF  [C0402_TI]  56.26,22.73 90 top
C14  220nF  [C0402_TI]  65.41,22.73 90 top
C15  22uF/6.3V  [C0603_DWS]  47.12,41.02 180 bottom
C16  220nF  [C0402_TI]  44.73,29.57 0 bottom
C17  220nF  [C0402_TI]  44.73,30.56 0 bottom
C18  220nF  [C0402_TI]  39.55,29.29 270 bottom
C19  220nF  [C0402_TI]  53.78,36.83 180 bottom
C20  220nF  [C0402_TI]  63.5,34.29 0 top
C21  220nF  [C0402_TI]  58.17,31.62 90 bottom
C22  220nF  [C0402_TI]  61.09,29.46 90 bottom
C23  220nF  [C0402_TI]  63.5,25.02 0 top
C24  220nF  [C0402_TI]  61.09,33.53 90 bottom
C25  220nF  [C0402_TI]  51.44,26.16 270 top
C26  220nF  [C0402_TI]  63.5,32.26 0 top
C27  220nF  [C0402_TI]  63.5,26.03 180 top
C28  220nF  [C0402_TI]  38.48,23.5 90 bottom
C29  220nF  [C0402_TI]  37.8,27.94 0 bottom
C30  220nF  [C0402_TI]  37.46,31.5 180 bottom
C31  220nF  [C0402_TI]  39.55,27.36 270 bottom
C32  220nF  [C0402_TI]  35.13,24.87 180 bottom
C33  220nF  [C0402_TI]  44.63,26.9 0 bottom
C34  220nF  [C0402_TI]  42.06,27.94 180 bottom
C35  220nF  [C0402_TI]  42.44,33.1 270 bottom
C36  220nF  [C0402_TI]  41.5,33.1 270 bottom
C37  220nF  [C0402_TI]  43.38,33.1 270 bottom
C38  220nF  [C0402_TI]  61.09,31.5 270 bottom
C39  220nF  [C0402_TI]  63.5,36.32 0 top
C40  220nF  [C0402_TI]  61.09,35.5 270 bottom
C41  220nF  [C0402_TI]  63.5,35.31 180 top
C42  220nF  [C0402_TI]  63.5,27.05 0 top
C43  220nF  [C0402_TI]  63.5,33.27 180 top
C44  220nF  [C0402_TI]  61.47,27.18 90 bottom
C45  220nF  [C0402_TI]  59.56,38.73 180 top
C46  220nF  [C0402_TI]  63.5,31.24 180 top
C47  1nF  [C0402_TI]  29.08,54.48 90 top
C48  220nF  [C0402_TI]  41.25,23.5 90 bottom
C49  220nF  [C0402_TI]  54.74,50.04 0 bottom
C50  220nF  [C0402_TI]  40.28,23.5 90 bottom
C51  220nF  [C0402_TI]  37.52,23.5 90 bottom
C52  220nF  [C0402_TI]  39.38,23.5 90 bottom
C53  220nF  [C0402_TI]  39.55,25.43 270 bottom
C54  NA(22uF/6.3V)  [C0603_DWS]  17.14,32.89 90 bottom
C55  10uF/6.3V  [C0603_DWS]  58.55,9.78 0 bottom
C56  220nF  [C0402_TI]  40.56,33.1 90 bottom
C57  220nF  [C0402_TI]  37.72,33.1 90 bottom
C58  220nF  [C0402_TI]  39.62,33.15 90 bottom
C59  NA  [C0603_DWS]  53.47,22.35 90 top
C60  100nF  [C0402_TI]  54.74,12.7 270 top
C61  100nF  [C0402_TI]  55.75,15.75 270 top
C62  1uF/6.3V  [C0603_DWS]  54.48,15.37 270 top
C63  100nF  [C0402_TI]  63.37,9.02 90 top
C64  100nF  [C0402_TI]  61.47,16.26 270 top
C65  220nF  [C0402_TI]  35.13,31.32 0 bottom
C66  220nF  [C0402_TI]  39.93,35.08 0 bottom
C67  220nF  [C0402_TI]  35.13,27.69 180 bottom
C68  220nF  [C0402_TI]  39.5,15.88 90 bottom
C69  220nF  [C0402_TI]  39.55,31.22 90 bottom
C70  220nF  [C0402_TI]  44.73,22.99 0 bottom
C71  220nF  [C0402_TI]  43.18,23.5 90 bottom
C72  220nF  [C0402_TI]  42.21,23.5 90 bottom
C73  220nF  [C0402_TI]  36.55,23.5 90 bottom
C74  22uF/6.3V  [C0603_DWS]  62.74,16.76 270 top
C75  22uF/6.3V  [C0603_DWS]  61.85,19.18 0 top
C76  100nF  [C0402_TI]  63.88,13.97 180 bottom
C77  220nF  [C0402_TI]  35.13,23.95 0 bottom
C78  220nF  [C0402_TI]  35.13,22.99 0 bottom
C79  10uF/6.3V  [C0603_DWS]  37.66,14.54 180 top
C80  100nF  [C0402_TI]  37.02,15.75 180 top
C81  22pF  [C0603_DWS]  53.15,24.89 270 bottom
C82  NA(100nF)  [C0402_TI]  19.3,41.4 180 top
C83  NA(100nF)  [C0402_TI]  21.59,41.4 0 top
C84  NA(100nF)  [C0402_TI]  21.59,18.29 0 top
C85  22pF  [C0603_DWS]  53.15,21.59 90 bottom
C86  27pF  [C0402_TI]  61.09,21.21 180 top
C87  27pF  [C0402_TI]  53.34,18.8 270 top
C88  NA  [C1206_5MILS_WS_ISO]  70.1,4.06 180 bottom
C89  1nF/2kV/X7R/1206  [C1206_5MILS_WS_ISO]  70.1,19.94 180 bottom
C90  27pF  [C0402_TI]  27.69,24.89 180 bottom
C91  27pF  [C0402_TI]  29.72,24.89 0 bottom
C92  22uF/6.3V  [C0603_DWS]  51.18,18.8 90 top
C93  100nF  [C0402_TI]  44.63,25.93 0 bottom
C94  22uF/6.3V  [C0603_DWS]  31.62,41.78 180 top
C95  220nF  [C0402_TI]  35.28,30.43 180 bottom
C96  22uF/6.3V  [C0603_DWS]  16.38,7.75 0 bottom
C97  22uF/6.3V  [C0603_DWS]  31.62,44.83 180 top
C98  22uF/6.3V  [C0603_DWS]  16.38,9.27 0 bottom
C99  1uF/6.3V  [C0603_DWS]  26.67,44.83 180 bottom
C100  220nF  [C0402_TI]  26.16,42.55 180 bottom
C101  10uF/6.3V  [C0603_DWS]  26.29,41.4 0 top
C102  10uF/6.3V  [C0603_DWS]  26.29,44.7 0 top
C103  220nF  [C0402_TI]  26.16,43.56 180 bottom
C104  220nF  [C0402_TI]  31.52,28.69 90 bottom
C105  220nF  [C0402_TI]  30.42,28.69 90 bottom
C106  220nF  [C0402_TI]  32.89,40.26 180 top
C107  220nF  [C0402_TI]  35.05,40.26 0 top
C108  10uF/6.3V  [C0603_DWS]  35.56,39.5 270 bottom
C109  100nF  [C0402_TI]  17.02,2.92 180 top
C110  100nF  [C0402_TI]  9.91,8 270 top
C111  100nF  [C0402_TI]  21.84,12.7 270 top
C112  NA(22uF/6.3V)  [C0603_DWS]  15.75,11.05 90 top
C113  1nF  [C0402_TI]  22.99,49.02 0 top
C114  1nF  [C0402_TI]  22.99,51.05 0 top
C115  1nF  [C0402_TI]  22.86,47.12 0 top
C116  1nF  [C0402_TI]  22.99,50.04 0 top
C117  10uF/6.3V  [C0603_DWS]  78.36,20.19 0 bottom
C118  22uF/6.3V  [C0603_DWS]  78.36,23.24 180 bottom
C119  22uF/6.3V  [C0603_DWS]  46.61,42.67 90 top
C120  100nF  [C0402_TI]  77.47,26.16 270 bottom
C121  220nF  [C0402_TI]  35.13,26.8 180 bottom
C122  22uF/6.3V  [C0603_DWS]  50.67,42.67 90 top
C123  220nF  [C0402_TI]  35.13,25.83 180 bottom
C124  10uF/6.3V  [C0603_DWS]  78.36,28.83 0 bottom
C125  22uF/6.3V  [C0603_DWS]  78.36,31.88 180 bottom
C126  100nF  [C0402_TI]  77.47,34.29 270 bottom
C127  10nF  [C0402_TI]  8.64,40.13 0 bottom
C128  10nF  [C0402_TI]  8.64,41.02 0 bottom
C129  10nF  [C0402_TI]  8.64,43.94 0 bottom
C130  10uF/6.3V  [C0603_DWS]  71.88,39.5 0 bottom
C131  10nF  [C0402_TI]  8.64,44.83 0 bottom
C132  10uF/6.3V  [C0603_DWS]  66.55,38.23 90 bottom
C133  1uF/6.3V  [C0603_DWS]  72.9,46.23 0 bottom
C134  10uF/6.3V  [C0603_DWS]  75.18,41.66 270 top
C135  10uF/6.3V  [C0603_DWS]  72.9,47.75 180 bottom
C136  10uF/6.3V  [C0603_DWS]  69.98,48.13 90 bottom
C137  220nF  [C0402_TI]  38.66,33.1 90 bottom
C138  10uF/6.3V  [C0603_DWS]  65.02,38.23 90 bottom
C139  22uF/6.3V  [C0603_DWS]  43.81,41.02 0 bottom
C140  22uF/6.3V  [C0603_DWS]  7.49,54.99 90 bottom
C141  NA(22uF/6.3V)  [C0603_DWS]  5.97,54.99 90 bottom
C142  10uF/6.3V  [C0603_DWS]  53.09,50.55 90 top
C143  1nF  [C0402_TI]  54.36,50.93 90 top
C144  10uF/6.3V  [C0603_DWS]  66.93,51.69 0 top
C145  1uF/6.3V  [C0603_DWS]  59.18,41.53 90 bottom
C146  10uF/6.3V  [C0603_DWS]  53.47,44.45 90 top
C147  1nF  [C0402_TI]  52.2,44.45 90 top
C148  22uF/6.3V  [C0603_DWS]  7.49,51.69 90 bottom
C149  10uF/6.3V  [C0603_DWS]  60.2,49.02 90 bottom
C150  1uF/6.3V  [C0603_DWS]  61.98,38.23 90 bottom
C151  22uF/6.3V  [C0603_DWS]  22.99,35.81 180 bottom
C152  220nF  [C0402_TI]  35.13,29.54 180 bottom
C153  10uF/6.3V  [C0603_DWS]  63.5,38.23 270 bottom
C154  1uF/6.3V  [C0603_DWS]  60.07,40.51 0 top
C155  22uF/6.3V  [C0603_DWS]  49.15,42.67 90 top
C156  220nF  [C0402_TI]  35.13,28.58 180 bottom
C157  10uF/6.3V  [C0603_DWS]  60.71,41.53 90 bottom
C158  10uF/6.3V  [C0603_DWS]  58.67,49.02 90 bottom
C159  10uF/6.3V  [C0603_DWS]  71.88,42.55 0 top
C160  10uF/6.3V  [C0603_DWS]  71.88,41.02 0 top
C161  1nF  [C0402_TI]  69.98,48.64 270 top
C162  220nF  [C0402_TI]  34.9,33.1 270 bottom
C163  10uF/6.3V  [C0603_DWS]  56.52,49.02 90 bottom
C164  22uF/6.3V  [C0603_DWS]  22.99,37.34 180 bottom
C165  22uF/6.3V  [C0603_DWS]  19.68,50.55 0 top
C166  22uF/6.3V  [C0603_DWS]  19.68,43.69 180 top
C167  100nF  [C0402_TI]  20.07,44.96 180 top
C168  220nF  [C0402_TI]  36.78,33.1 270 bottom
C169  22uF/6.3V  [C0603_DWS]  35.18,44.58 0 top
C170  220nF  [C0402_TI]  35.84,33.1 270 bottom
C171  470nF  [C0603_DWS]  35.18,43.05 0 top
C172  22uF/6.3V  [C0603_DWS]  31.62,43.31 180 top
C173  470nF  [C0603_DWS]  35.18,41.53 0 top
C174  470uF/10V/105C  [E2,5-6,3]  69.09,56.13 90 top
C175  22pF  [C0603_DWS]  46.74,45.72 270 bottom
C176  22uF/6.3V  [C0603_DWS]  54.36,41.4 90 bottom
C177  22uF/6.3V  [C0603_DWS]  51.82,45.72 270 bottom
C178  22uF/6.3V  [C0603_DWS]  53.34,45.72 270 bottom
C179  22uF/6.3V  [C0603_DWS]  77.72,42.55 180 bottom
C180  22uF/6.3V  [C0603_DWS]  79.12,42.67 0 top
C181  22uF/6.3V  [C0603_DWS]  77.47,48.39 180 bottom
C182  22uF/6.3V  [C0603_DWS]  32,52.2 90 bottom
C183  22pF  [C0603_DWS]  25.78,57.78 270 top
C184  22uF/6.3V  [C0603_DWS]  27.05,55.88 270 bottom
C185  22uF/6.3V  [C0603_DWS]  25.53,55.88 270 bottom
C186  22uF/6.3V  [C0603_DWS]  77.72,41.02 180 bottom
C187  47uF/6.3V  [C0805_5MIL_D]  71.5,23.11 270 bottom
C188  47uF/6.3V  [C0805_5MIL_D]  71.5,32.77 270 bottom
C189  47uF/6.3V  [C0805_5MIL_D]  11.94,11.05 90 top
C190  47uF/6.3V  [C0805_5MIL_D]  8.51,54.48 90 top
C191  NA(22uF/6.3V)  [C0603_DWS]  73.66,23.5 270 bottom
C192  NA(22uF/6.3V)  [C0603_DWS]  73.66,33.15 270 bottom
C193  22uF/6.3V  [C0603_DWS]  78.36,21.72 180 bottom
C194  22uF/6.3V  [C0603_DWS]  78.36,30.35 180 bottom
C195  NA(2.2uF/6.3V)  [C0603_DWS]  15.62,32.89 270 bottom
C196  NA(100nF)  [C0402_TI]  18.72,26.59 0 bottom
C197  NA(2.2uF/6.3V)  [C0603_DWS]  19.43,36.7 270 bottom
C198  NA(100nF)  [C0402_TI]  20.7,36.07 90 bottom
C199  NA(100nF)  [C0402_TI]  25.53,29.46 0 bottom
C200  NA(2.2uF/6.3V)  [C0603_DWS]  26.16,30.73 180 bottom
C201  47uF/6.3V  [C0805_5MIL_D]  13.97,11.05 90 top
C202  47uF/6.3V  [C0805_5MIL_D]  6.48,54.48 90 top
C203  NA(100nF)  [C0402_TI]  6.86,31.5 270 bottom
CASE  CASE_HAMMOND_1593LBK-1  [HAMMOND_1593LBK_A10_LIME_NO_MILLING]  0,0 0 top
CHGLED  LED/YELLOW/0603  [LED-0603_TEST]  77.85,41.02 0 top
D1  1N5819(S4SOD-123)  [SOD-123]  53.21,17.91 180 bottom
D2  1N5819(S4SOD-123)  [SOD-123]  56.9,1.4 0 bottom
D3  NA(1N5822/SS34/SMA)  [MLL-41]  77.6,58.29 0 bottom
D4  SMBJ6.0A  [DO214AA]  77.47,45.21 0 top
D5  1N5822/SS34/SMA  [MELF-MLL41]  80.39,38.23 180 bottom
D6  1N4148/SOD80C  [MINI-MELF]  12.45,38.61 270 top
FET1  IRLML6402  [SOT23]  10.29,57.28 270 bottom
FET2  IRLML6402  [SOT23]  71.5,51.18 90 top
FET3  IRLML6402  [SOT23]  71.88,57.4 0 bottom
FET4  BSS138(SOT23-3)  [SOT23]  71.88,53.34 270 bottom
FUSE1  FSMD035  [1206]  11.68,32 270 bottom
GND  TESTPADTESTPAD_40-ROUND  [TESTPAD_40-ROUND]  20.07,58.42 0 top
GND_PIN  TESTPAD3  [TEST_PAD40/70/SQUARE]  26.16,1.27 0 top
GPIO-1  GPH127SMT-02X20(PA-V16X-2X20-LF)  [YA-V36P-2X20-LF]  38.1,50.16 0 top
GPIO-2  GPH127SMT-02X20(PA-V16X-2X20-LF)  [YA-V36P-2X20-LF]  38.1,9.52 0 top
GPIO-3  GPH127SMT-02X20(PA-V16X-2X20-LF)  [YA-V36P-2X20-LF]  45.72,3.17 0 top
GPIO-4  GPH127SMT-02X10(PA-V16X-2X10-LF)  [YA-V36P-2X10-LF]  14.86,53.09 90 top
HDMI  HDMI-SWM-19  [HDMI-SWM-19]  4.19,25.27 90 top
IPSOUT  TESTPADTESTPAD_40-ROUND  [TESTPAD_40-ROUND]  58.8,45.59 0 bottom
L1  NA(FB0805/600R/2A)  [L0805_5MIL_DWS]  15.37,36.58 270 bottom
L2  FB0805/600R/2A  [L0805_5MIL_DWS]  64.52,18.29 90 top
L4  FB0805/600R/2A  [L0805_5MIL_DWS]  16.13,5.21 0 bottom
L5  FB0805/600R/2A  [L0805_5MIL_DWS]  9.65,11.05 90 top
L6  FB0805/600R/2A  [L0805_5MIL_DWS]  9.4,3.17 270 top
L7  FB0805/600R/2A  [L0805_5MIL_DWS]  78.99,26.03 90 bottom
L8  FB0805/600R/2A  [L0805_5MIL_DWS]  78.99,34.67 90 bottom
L9  FB0805/600R/2A  [L0805_5MIL_DWS]  71.75,27.94 0 bottom
L10  2.2uH/1.5A/DCR<0.1R/CD32  [CD32]  72.39,46.23 270 top
L11  2.2uH/1.5A/DCR<0.1R/CD32  [CD32]  56.77,50.93 270 top
L12  2.2uH/1.5A/DCR<0.1R/CD32  [CD32]  56.26,45.21 270 top
L13  2.2uH/1.5A/DCR<0.1R/CD32  [CD32]  56.13,45.21 90 bottom
L14  2.2uH/1.5A/DCR<0.1R/CD32  [CD32]  81.41,47.37 270 bottom
L15  2.2uH/1.5A/DCR<0.1R/CD32  [CD32]  29.97,57.4 0 bottom
LAN  RJLBC-060TC1  [RJLBC-060TC1_MILLING]  76.83,12.06 90 top
LCD_CON  GPH127SMT-02X20(PA-V16X-2X20-LF)  [YA-V36P-2X20-LF]  45.72,56.52 0 top
LED1  LED/GREEN/0603  [LED-0603_TEST]  28.7,2.16 90 top
LIPO_BAT  DW02R  [DW02R]  81.53,43.43 90 top
NAND_E  Close  [SJ_1_SMALLER_CLOSE_10MILS]  22.61,42.04 0 bottom
PB9/PH7_GPIO  PB9:Opened/PH7_GPIO:Closed  [SJ_2_SMALL_23_TIED]  38.73,4.83 0 bottom
PB9/PH7_USB  PB9:Closed/PH7_USB:Opened  [SJ_2_SMALL_23_TIED]  38.73,6.86 180 bottom
PC3/PB8  PC3:Closed/PB8:Opened  [SJ_2_SMALL_23_TIED]  10.29,47.24 180 bottom
PWR  SIDE_WTCM-TR(3X4)  [SW_TAKT3X4]  1.4,54.36 90 bottom
PWR_JACK  PWRJ-2mm(YDJ-1134)  [PWR_JACK_UNI_MILLING]  74.55,56.64 180 top
PWR_LED  LED/RED/0603  [LED-0603_TEST]  80.26,58.17 180 top
Q1  Q25MHZ/20pF/20ppm/2P/5x3.2mm  [HCX-4S_TEST]  57.15,18.8 0 top
Q2  Q32.768kHz/12.5pF/20ppm/4P/SMD8038  [MC-306_TEST]  58.29,23.24 180 bottom
Q3  Q24MHZ/20pF/20ppm/2P/5x3.2mm  [HCX-4S_TEST]  27.43,22.35 0 bottom
R1  2k/1%  [R0603_5MIL_DWS]  30.48,2.16 90 top
R2  2k/1%  [R0603_5MIL_DWS]  63.25,22.35 270 top
R3  2k/1%  [R0603_5MIL_DWS]  58.42,22.35 270 top
R4  NA  [R0603_5MIL_DWS]  60.83,23.24 180 top
R5  2k/1%  [R0603_5MIL_DWS]  66.67,22.35 90 top
R6  2k/1%  [R0603_5MIL_DWS]  54.99,22.35 90 top
R7  2k/1%  [R0603_5MIL_DWS]  47.62,38.73 0 bottom
R8  330R/1%  [R0603_5MIL_DWS]  63.5,28.38 180 top
R9  22R  [R0402_TI]  50.93,34.16 180 top
R10  100k/1%  [R0603_5MIL_DWS]  30.35,55.12 270 top
R11  22R  [R0402_TI]  50.93,33.27 180 top
R12  0R_board_mounted  [R0402_TI_0R]  47.62,37.47 0 bottom
R13  0R_board_mounted  [R0402_TI_0R]  47.62,36.58 0 bottom
R14  330R/1%  [R0603_5MIL_DWS]  43.81,39.5 0 bottom
R15  NA(2.2k)  [R0603_5MIL_DWS]  26.42,4.06 270 bottom
R16  NA(2.2k)  [R0603_5MIL_DWS]  26.42,7.37 90 bottom
R17  NA(10k)  [R0402_TI]  23.62,41.4 0 top
R18  NA(10k)  [R0402_TI]  22.61,42.29 0 top
R19  10k  [R0402_TI]  56.64,6.98 90 bottom
R20  NA(10k)  [R0402_TI]  19.3,42.29 180 top
R21  13k/1%  [R0603_5MIL_DWS]  51.05,20.64 270 bottom
R22  NA  [R0402_TI]  58.29,4.57 90 bottom
R23  13k/1%  [R0603_5MIL_DWS]  37.66,16.95 0 top
R24  NA  [R0402_TI]  58.42,6.98 90 bottom
R25  10k  [R0402_TI]  57.53,6.98 90 bottom
R26  100k/1%  [R0603_5MIL_DWS]  26.04,11.56 180 bottom
R27  10k  [R0402_TI]  25.02,9.65 180 bottom
R28  200k/1%  [R0603_5MIL_DWS]  26.29,42.93 180 top
R29  10k  [R0402_TI]  11.81,18.03 90 bottom
R30  2k  [R0402_TI]  14.1,31.75 90 top
R31  2k  [R0402_TI]  13.21,31.75 90 top
R32  20k/5%/0402  [R0402_TI]  11.68,34.16 90 top
R33  4.99k/1%  [R0603_5MIL_DWS]  17.02,1.65 180 top
R34  NA(0R)  [R0603_5MIL_DWS]  42.61,40.39 90 top
R35  10k  [R0402_TI]  21.84,10.67 270 top
R36  13k/1%  [R0603_5MIL_DWS]  14.1,8.25 0 top
R37  10k  [R0402_TI]  17.02,3.94 0 top
R38  NA  [R0603_5MIL_DWS]  47.5,54.36 0 bottom
R39  NA  [R0603_5MIL_DWS]  52.7,58.29 0 bottom
R40  10k  [R0402_TI]  82.04,20.32 180 bottom
R41  6.81k/1%  [R0603_5MIL_DWS]  81.79,26.16 180 bottom
R42  13k/1%  [R0603_5MIL_DWS]  11.81,3.17 90 top
R43  2k/1%  [R0603_5MIL_DWS]  43.69,45.72 270 bottom
R44  2k/1%  [R0603_5MIL_DWS]  45.21,45.72 270 bottom
R45  2k/1%  [R0603_5MIL_DWS]  52.83,49.02 270 bottom
R46  2k/1%  [R0603_5MIL_DWS]  51.31,49.02 270 bottom
R47  10k  [R0402_TI]  82.04,28.45 180 bottom
R48  13k/1%  [R0603_5MIL_DWS]  81.79,34.29 180 bottom
R49  10k  [R0402_TI]  53.34,1.4 90 bottom
R50  330R/1%  [R0603_5MIL_DWS]  71.88,39.5 180 top
R51  0.03R/1%  [R1206_5MIL_WS]  72.64,42.93 90 bottom
R52  10k  [R0402_TI]  10.29,54.48 180 bottom
R53  100k/1%  [R0603_5MIL_DWS]  66.55,31.11 90 bottom
R54  10k  [R0402_TI]  9.78,49.15 180 bottom
R55  200k/1%  [R0603_5MIL_DWS]  66.55,34.42 90 bottom
R56  2k  [R0402_TI]  78.99,39.75 180 top
R57  191R/1%  [R0603_5MIL_DWS]  26.67,41.27 180 bottom
R58  4.99k/1%  [R0603_5MIL_DWS]  5.97,51.69 270 bottom
R59  200k/1%  [R0603_5MIL_DWS]  60.07,42.04 0 top
R60  2k  [R0402_TI]  69.09,48.64 270 top
R61  2k  [R0402_TI]  66.93,50.42 180 top
R62  2k  [R0402_TI]  67.18,51.44 90 bottom
R63  2k  [R0402_TI]  62.99,40.13 180 top
R64  2k  [R0402_TI]  68.07,51.44 90 bottom
R65  2k/1%  [R0603_5MIL_DWS]  76.96,58.17 0 top
R66  0R(Board_Mounted)  [0603_0R]  66.8,56.77 270 bottom
R67  8.25k/1%  [R0603_5MIL_DWS]  75.31,41.66 270 bottom
R68  4.99k/1%  [R0603_5MIL_DWS]  48.77,45.72 270 bottom
R69  1.1k/1%  [R0603_5MIL_DWS]  75.31,45.97 90 bottom
R70  3.32k/1%  [R0603_5MIL_DWS]  47.88,43.31 0 bottom
R71  4.99k/1%  [R0603_5MIL_DWS]  27.3,57.78 270 top
R72  1.1k/1%  [R0603_5MIL_DWS]  29.34,49.15 180 bottom
R73  10M  [R0402_TI]  51.94,23.24 90 bottom
R74  10k  [R0402_TI]  72.39,50.16 0 bottom
R75  13k/1%  [R0603_5MIL_DWS]  73.15,57.4 270 top
R76  NA  [R0402_TI]  18.67,42.29 270 bottom
R77  1M  [R0402_TI]  74.17,49.02 0 bottom
R78  330R/1%  [R0603_5MIL_DWS]  63.5,29.97 180 top
R79  12.1k/1%  [R0603_5MIL_DWS]  62.1,16 270 bottom
R80  49.9R/1%  [R0402_TI]  63.88,12.06 0 top
R81  49.9R/1%  [R0402_TI]  63.88,10.79 0 top
R82  49.9R/1%  [R0402_TI]  63.88,14.22 0 top
R83  49.9R/1%  [R0402_TI]  63.88,12.95 0 top
R84  10k  [R0402_TI]  59.94,16.26 0 bottom
R85  330R/1%  [R0603_5MIL_DWS]  79.25,17.78 90 bottom
R86  330R/1%  [R0603_5MIL_DWS]  77.34,3.43 0 bottom
R87  NA(22R)  [R0402_TI]  20.92,22.99 0 bottom
R88  NA(10k)  [R0402_TI]  20.92,24.89 0 bottom
R89  NA(22R)  [R0402_TI]  20.92,23.99 180 bottom
R90  NA(22R)  [R0402_TI]  21.52,26.59 0 bottom
R91  NA(10k)  [R0402_TI]  20.62,28.49 0 bottom
R92  NA  [R0402_TI]  2.92,19.56 180 bottom
R93  NA(10k)  [R0402_TI]  5.08,19.56 0 bottom
R94  NA(10k)  [R0402_TI]  5.33,30.99 180 bottom
R95  NA(10k)  [R0402_TI]  7.24,19.56 180 bottom
R96  NA  [R0402_TI]  20.62,29.39 0 bottom
R97  10k  [R0402_TI]  11.68,31.75 270 top
R98  27k  [R0402_TI]  14.1,38.23 90 top
RECOVERY  SIDE_WTCM-TR(3X4)  [SW_TAKT3X4]  1.4,37.85 90 bottom
RESET  SIDE_WTCM-TR(3X4)  [SW_TAKT3X4]  1.4,46.1 90 bottom
RM1  RA1206_(4X0603)_4B8_1.5k  [R_MATRIX_4]  54.1,5.97 0 bottom
RM2  RA1206_(4X0603)_4B8_10k  [R_MATRIX_4]  52.32,14.48 270 bottom
RM3  NA(RA1206_(4X0603)_4B8_10k)  [R_MATRIX_4]  16.38,23.24 90 bottom
RM4  RA1206_(4X0603)_4B8_100K  [R_MATRIX_4]  16.38,2.16 270 bottom
RM5  RA1206_(4X0603)_4B8_10k  [R_MATRIX_4]  50.16,2.16 180 bottom
RM6  NA(RA0805_(4X0402)_22R)  [R_MATRIX_4_0402_25X625_BIGGEROUTPADS]  19.56,20.95 0 bottom
RM7  NA(RA0805_(4X0402)_22R)  [R_MATRIX_4_0402_25X625_BIGGEROUTPADS]  22.61,20.95 0 bottom
RM8  NA(RA1206_(4X0603)_4B8_10k)  [R_MATRIX_4]  16.38,29.21 90 bottom
RM9  RA1206_(4X0603)_4B8_22R  [R_MATRIX_4]  52.07,53.59 0 bottom
RM10  NA(RA1206_(4X0603)_4B8_22R)  [R_MATRIX_4]  56.26,53.59 0 bottom
SATA  SATA-PWA-07  [SATA-PWA-07]  3.98,42.91 90 top
SD/MMC1  TFC-WPAPR-08  [TFC-WPAPR-08]  5.84,8.63 0 bottom
T1  BC846B  [SOT23]  10.29,51.69 0 bottom
U1  K4B4G1646D-BCK0  [FBGA96_MEM]  56.82,31.09 270 top
U2  LAN8710A-EZC(QFN-32)  [QFN-32(DRILLS)]  58.8,11.94 180 top
U3  AT24C16C-SSHM-T(SOIC-8)  [SO-08MN]  30.1,5.08 0 bottom
U4  NA(H27UBG8T2BTR_or_MT29F64G08CBABAWP:BTR(8GB_NAND))  [TSOP48]  21.46,29.84 270 top
U5  NA(RCLAMP0524P)  [SLP2510P8_TEST]  13.21,22.35 90 top
U6  NA(RCLAMP0524P)  [SLP2510P8_TEST]  13.21,25.4 90 top
U7  A20  [TFBGA441]  39.92,28.29 90 top
U8  NA(RCLAMP0524P)  [SLP2510P8_TEST]  13.21,28.45 90 top
U9  SY6280(SOT23-5)  [SOT23-5]  18.92,11.18 180 top
U10  SY6280(SOT23-5)  [SOT23-5]  81.53,23.24 90 bottom
U11  SY6280(SOT23-5)  [SOT23-5]  81.53,31.37 90 bottom
U12  AXP209(QFN48)  [QFN48]  65.15,44.96 180 top
U13  SY8089AAAC(SOT23-5)  [SOT23-5]  51.82,41.91 90 bottom
U14  MT3608(SOT23-6)  [SOT23-6]  77.72,45.47 270 bottom
U15  SY8089AAAC(SOT23-5)  [SOT23-5]  29.34,52.32 90 bottom
U16  FIDUCIAL  [FIDUCIAL-1X3]  6.1,58.04 180 top
U17  FIDUCIAL  [FIDUCIAL-1X3]  82.42,1.52 180 top
U18  FIDUCIAL  [FIDUCIAL-1X3]  4.7,58.17 0 bottom
U19  FIDUCIAL  [FIDUCIAL-1X3]  82.42,1.52 0 bottom
U20  MCP120T475I-TT  [SOT23]  77.72,51.82 270 bottom
U21  NA(MTFC4GACAANA-4M_IT(TBGA100))  [TBGA100]  22.22,30.19 270 top
U22  NA(W25Q128FVSIG)  [SO-8-BIG]  4.19,25.27 0 bottom
U$1  [ATTENTION_SMALL]  78.61,52.83 90 bottom
U$5  [LOGO-OPENHARDWARE_8X8]  33.78,14.99 0 bottom
U$8  [OLIMEX1_V]  34.67,13.34 0 top
U$9  [PB]  19.81,48.51 0 bottom
U$10  [ESD_SYMBOL]  24.13,12.32 0 bottom
U$11  [RECYCLE_BIN1/8]  41.53,42.42 0 bottom
U$12  [ROHS]  42.29,5.08 90 bottom
UART0  HN1X3  [HN1X3]  69.85,1.52 0 top
USB_HOST1  USB_A_VERTICAL  [USB_A_VERTICAL_PTH]  87.88,22.61 90 top
USB_HOST2  USB_A_VERTICAL  [USB_A_VERTICAL_PTH]  87.88,32.26 90 top
USB_OTG  USB-OTG  [USB_MINI_9PIN]  3.05,7.63 180 top
VR1  AP1231-2.5V(SOT23-5)  [SOT-23-5]  19.94,47.62 90 top
WP_ENABLE  Opened  [SJ_1_SMALLER]  0.89,19.3 90 bottom

## Tracks (layer width: path | path; a pad name or v marks a point on that pad's centre or on a via)
5VEXT  (via drill 0.6)
  Top 0.203: U12.32 65.75,41 65.96,41 66.15,41 U12.33
  Top 0.508: 74.68,54.23 74.68,56.77 R65.1
  Top 0.61: v66.22,40.26 65.96,40.51 65.96,41
  Top 0.762: PWR_JACK.+ 74.74,50.35 74.55,50.15 74.55,46.74 75.29,45.99 D4.C
  Top 1.016: C174.+ 69.72,54.23 74.68,54.23 | PWR_JACK.+ 74.68,51.96
  Top 1.422: 74.68,51.96 74.68,54.23
  Route14 0.813: v66.22,40.26 66.22,41.2
  Route14 1.016: 66.22,41.2 66.22,41.71 68.58,44.07 68.58,46.1 69.98,47.5 73.02,47.5 74.04,48.51 74.04,49.78 74.74,50.49 PWR_JACK.+
  Bottom 0.254: v66.22,40.26 5VEXT.1
  Bottom 0.508: 69.34,53.34 5V_E.1
  Bottom 0.61: v66.22,40.26 66.55,39.93 C132.2 | 74.8,50.42 74.55,50.16 R74.1
  Bottom 0.762: C174.+ 69.34,54.61 69.34,53.34 | U20.2 76.77,50.42 74.8,50.42
  Bottom 1.016: PWR_JACK.+ 74.8,51.89 74.8,50.42 | D3.A 75.06,58.29 74.3,57.53 74.3,57.4 FET3.3
  Bottom 1.27: PWR_JACK.+ 74.74,53.52 74.3,53.97 74.3,57.4
+5V  (via drill 0.5, 0.6)
  Top 0.508: v13.33,34.04 13.33,32.26 | v20.57,13.08 20.57,13.21 C111.1 | U9.5 20.38,12.13 20.57,12.32 | 13.33,32.26 R31.2 | 13.33,32.26 R30.2 | GPIO-2.1 26.04,10.79 25.65,10.41 25.65,9.27 v25.02,8.64
  Top 0.762: 20.57,12.57 20.57,12.32 | v24.51,51.05 v25.27,51.05 25.65,51.05 26.04,51.44 GPIO-1.1 | v32.64,56.52 v32.64,57.28 33.66,58.29 LCD_CON.1 | GPIO-3.1 33.66,4.19 v33.27,3.81
  Top 0.889: v69.72,51.31 69.72,51.45 FET2.2
  Top 1.016: v13.33,34.04 v13.33,34.92 | R75.1 72.77,58.67 v72.01,58.67 | v20.57,13.08 20.57,12.57
  Route3 0.762: 32.39,56.64 32.64,56.64 | 32.64,56.64 v32.64,56.52 | 32.64,56.64 v32.64,57.28 | v24.51,51.05 v25.27,51.05
  Route3 1.016: 32.39,56.64 31.37,56.64 25.78,51.05 v25.27,51.05
  Route14 0.762: 33.15,3.81 v33.27,3.81 | 71.88,58.55 v72.01,58.67
  Route14 1.016: v80.26,20.57 79.25,21.59 79.25,27.94 v80.26,28.96 80.26,29.78 83.06,32.58 83.06,54.1 v82.17,54.99 80.01,54.99 79.63,54.61 75.69,54.61 75.31,54.99 73.41,54.99 72.77,54.36 70.61,54.36 | 33.15,3.81 33.02,3.81 31.62,2.41 29.08,2.41 26.8,4.7 26.8,6.86 v25.02,8.64 24.51,8.64 23.37,9.78 22.86,9.78 20.57,12.06 v20.57,13.08 20.19,13.46 18.03,13.46 17.91,13.34 13.84,13.34 12.45,14.73 12.45,16.89 13.08,17.53 13.08,33.78 v13.33,34.04 v13.33,34.92 | v69.72,51.31 70.61,52.2 70.61,54.36 | 70.61,54.36 70.61,57.28 71.88,58.55
  PWR 0.762: v32.64,57.28 v32.64,56.52 32.39,56.52 | v24.51,51.05 v25.27,51.05
  PWR 1.016: v13.33,34.04 v13.33,34.92 9.91,38.35 6.86,38.35 5.21,40 5.21,45.08 6.35,46.23 8.25,46.23 | v24.51,51.05 23.88,51.05 22.1,49.28 17.4,49.28 16.89,48.77 16.89,46.74 16.38,46.23 8.25,46.23 | 8.25,46.23 8.25,57.02 v8.76,57.53 | 32.39,56.52 32.39,55.12 33.02,54.48 57.02,54.48 60.96,50.55 63.75,50.55 64.52,51.31 v69.72,51.31
  Bottom 0.508: U11.5 80.58,29.28 v80.26,28.96 | v80.26,20.57 80.58,20.89 U10.5 | 8,57.53 5V_E_SATA.1 | 69.34,52.32 5V_E.2 | v13.33,34.92 13.08,34.92 +5V.1
  Bottom 0.61: 9.4,54.48 R52.1
  Bottom 0.762: 8,57.53 v8.76,57.53 9.34,56.96 FET1.2 9.4,56.12 9.4,54.48 | v69.72,51.31 69.34,51.69 69.34,52.32 | v72.01,58.67 71.1,58.67 FET3.2
  Bottom 1.016: v80.26,20.57 79.88,20.19 C117.1 | FUSE1.1 12.32,34.04 v13.33,34.04 v13.33,34.92 | v80.26,28.96 80.14,28.83 C124.1 | v82.17,54.99 82.17,56.26 80.14,58.29 D3.K
+5V_OTG_PWR  (via drill 0.4, 0.6)
  Top 0.203: U12.31 65.35,40.97 65.2,40.82
  Top 0.508: 9.91,9.27 9.91,9.78 L5.1 | 9.91,9.27 C110.1 | v6.99,10.03 6.77,9.82 USB_OTG.VBUS 6.81,9.27 9.91,9.27 | v65.1,40.03 65.2,40.13 65.2,40.82
  Top 0.762: v65.79,29.46 65.79,30.35 | 65.79,30.35 v65.53,30.35 | 65.79,30.35 65.79,30.73 | 65.15,39.37 65.1,39.42 v65.1,40.03
  Top 1.016: 65.79,30.73 65.79,33.53 67.69,35.43 67.69,36.83 65.15,39.37 | v6.99,10.03 v7.87,10.03 L5.1
  Route14 1.016: v6.99,10.03 v7.87,10.03 10.16,10.03 11.43,8.76 20.57,8.76 21.08,8.25 22.86,8.25 25.27,5.84 25.27,4.19 28.57,0.89 57.02,0.89 v58.93,2.79
  PWR 1.016: v58.93,2.79 58.93,3.05 58.04,3.94 58.04,5.46 63.25,10.67 63.25,18.54 65.79,21.08 65.79,22.86 66.29,23.37 66.29,28.96 v65.79,29.46 65.53,29.72 v65.53,30.35
  Bottom 0.762: v65.1,40.03 65.1,39.19 C138.2
  Bottom 1.016: R53.1 v65.79,29.46 65.79,30.35 v65.53,30.35
+24V  (via drill 0.4, 0.6)
  Top 0.203: U12.38 68.91,43.16 68.91,43.36 68.91,43.56 U12.39 | v70.1,44.45 69.85,44.45 69.54,44.76 U12.42
  Top 0.61: 68.91,43.36 v69.16,43.1 v69.16,42.49
  Top 1.016: LIPO_BAT.1 80.25,42.43 C180.2
  Route3 1.016: v72.52,48.89 72.52,48.01 77.72,42.8 81.17,42.8 LIPO_BAT.1
  PWR 0.508: v69.16,42.49 69.16,43.13
  Bottom 0.254: BAT.1 69.49,42.16 v69.16,42.49
  Bottom 0.813: v69.16,42.49 v69.16,43.1 69.16,43.51 v70.1,44.45 70.48,44.83 72.01,44.83
  Bottom 1.016: R51.2 72.2,44.83 72.01,44.83 C133.2 C135.1 72.01,48.13 72.52,48.64 v72.52,48.89
AXP_BACKUP  (via drill 0.3)
  Top 0.203: 64.95,41.33 U12.30
  Top 0.254: 64.95,41.33 64.64,41.02 64.64,40.51 64.26,40.13 v64.26,40
  PWR 0.254: v64.26,40 64.26,39.62 65.41,38.48 65.41,31.75 66.42,30.73 66.42,30.1 67.18,29.34 67.18,22.86 66.67,22.35 66.67,20.7 64.13,18.16 64.13,7.62 65.53,6.22 65.53,3.3 66.17,2.67 72.9,2.67 74.04,1.52 74.93,1.52
  PWR 1.016: 74.93,1.52 BACKUP.1
BA0  (via drill 0.25)
  Top 0.127: v54.02,27.89 U1.M2 | U7.K3 v47.52,26.29
  Bottom 0.127: v54.02,27.89 54.02,27.96 53.66,28.32 52.7,28.32 51.18,26.8 51.05,26.8 50.93,26.92 50.93,27.69 50.8,27.81 50.67,27.81 50.55,27.69 50.55,25.91 50.42,25.78 50.29,25.78 50.16,25.91 50.16,26.61 50.04,26.73 49.91,26.73 49.78,26.61 49.78,25.91 49.66,25.78 49.53,25.78 49.4,25.91 49.4,26.61 49.28,26.73 49.15,26.73 49.02,26.61 49.02,25.91 48.89,25.78 48.77,25.78 48.64,25.91 48.64,26.61 48.51,26.73 48.39,26.73 48.26,26.61 48.26,25.91 48.13,25.78 48.01,25.78 47.52,26.27 v47.52,26.29
BA1  (via drill 0.25)
  Top 0.127: v58.82,27.09 U1.N8 | U7.L4 v46.72,27.09
  Route3 0.127: v58.82,27.09 59.22,26.69 59.22,26.09 58.92,25.79 53.15,25.79 52.25,26.69 50.78,26.69 50.67,26.8 50.67,27.05 50.55,27.18 50.42,27.18 50.29,27.05 50.29,26.81 50.19,26.71 50.03,26.71 49.91,26.83 49.91,27.05 49.78,27.18 49.66,27.18 49.53,27.05 49.53,26.81 49.4,26.69 49.28,26.69 49.15,26.81 49.15,27.05 49.02,27.18 48.89,27.18 48.77,27.05 48.77,26.81 48.64,26.69 48.51,26.69 48.39,26.81 48.39,27.05 48.26,27.18 48.13,27.18 48.01,27.05 48.01,26.81 47.89,26.69 47.12,26.69 v46.72,27.09
BA2  (via drill 0.25)
  Top 0.127: v54.82,27.89 U1.M3 | v46.72,26.29 U7.K4
  Bottom 0.127: v54.82,27.89 54.42,27.49 52.26,27.49 51.44,26.67 51.44,25.02 51.31,24.89 51.18,24.89 51.05,25.02 51.05,25.4 50.93,25.53 50.8,25.53 50.67,25.4 50.67,25.02 50.55,24.89 50.42,24.89 50.29,25.02 50.29,25.4 50.16,25.53 50.04,25.53 49.91,25.4 49.91,25.02 49.78,24.89 49.66,24.89 49.53,25.02 49.53,25.4 49.4,25.53 49.28,25.53 49.15,25.4 49.15,25.02 49.02,24.89 48.89,24.89 48.77,25.02 48.77,25.4 48.64,25.53 48.51,25.53 48.39,25.4 48.39,25.02 48.26,24.89 48.01,24.89 47.8,25.09 47.32,25.09 47.12,25.29 47.12,25.89 v46.72,26.29
CASN  (via drill 0.25)
  Top 0.127: v54.82,30.29 U1.K3 | U7.U3 v47.52,32.69
  Bottom 0.127: v47.52,32.69 47.95,32.69 49.53,31.11 49.8,31.11 50.16,30.75 50.16,29.97 50.29,29.84 50.42,29.84 50.55,29.97 50.55,30.99 50.67,31.11 50.8,31.11 50.93,30.99 50.93,29.97 51.05,29.84 51.18,29.84 51.31,29.97 51.31,30.73 51.44,30.86 51.56,30.86 51.69,30.73 51.69,29.97 51.82,29.84 52.2,29.84 52.32,29.97 52.32,30.73 52.45,30.86 52.58,30.86 52.7,30.73 52.7,29.97 52.83,29.84 54.61,29.84 54.82,30.05 v54.82,30.29
CHASSIS  (via drill 0.6)
  Top 1.016: LAN.GND1 73.66,4.06 73.66,15.75 | LAN.GND2 73.66,20.06 73.66,15.75 | 73.66,15.75 v74.93,15.75
  Bottom 1.016: 73.73,19.94 C89.2 | C88.2 LAN.GND1
  Bottom 1.27: 73.73,19.94 LAN.GND2 73.79,20.06 73.79,19.56 | LAN.GND1
  Bottom 1.524: LAN.GND1 73.79,4.06 73.79,19.56
  other vias: 74.93,11.94 76.83,13.84 74.93,8.13 76.83,10.03 78.74,8.13 78.74,11.94 78.74,15.75 80.64,13.84 80.64,10.03 82.55,11.94 82.55,9.4 82.55,14.48
  pour Top (isolate 0.254): 72.9,19.81 83.57,19.81 83.57,13.59 83.57,4.32 73.53,4.32 72.9,4.32
  pour GND (isolate 0.254): 72.9,19.81 83.69,19.81 83.69,4.32 72.9,4.32
  pour Route3 (isolate 0.254): 72.9,19.81 83.69,19.81 83.69,4.32 72.9,4.32
  pour Route14 (isolate 0.254): 72.9,19.81 83.69,19.81 83.69,4.32 72.9,4.32
  pour PWR (isolate 0.254): 72.9,19.81 83.69,19.81 83.69,4.32 72.9,4.32
  pour Bottom (isolate 0.254): 72.9,19.81 83.69,19.81 83.69,4.32 72.9,4.32
CKE  (via drill 0.25, 0.25 pad 0.46)
  Top 0.127: v58.82,29.49 59.62,29.49 U1.K9 | U7.N3 v47.52,28.69
  Bottom 0.127: v58.82,29.49 58.47,29.84 57.78,29.84 57.02,29.08 49.78,29.08 49.66,28.96 49.66,27.94 49.53,27.81 49.4,27.81 49.28,27.94 49.28,28.96 49.15,29.08 47.91,29.08 v47.52,28.69
CLK  (via drill 0.25)
  Top 0.127: v56.9,32.51 57.4,32 57.4,30.4 57.53,30.28 58.24,30.28 58.42,30.45 U1.J7 | R9.1 51.56,34.04 v52.07,34.04
  Bottom 0.127: v56.9,32.51 56.77,32.38 56.39,32.38 56.26,32.51 56.26,34.52 56.01,34.77 55.5,34.77 55.24,34.52 55.24,32.89 55.12,32.77 52.7,32.77 52.58,32.89 52.58,33.53 v52.07,34.04
CLKN  (via drill 0.25)
  Top 0.127: v56.9,31.88 57.15,31.62 57.15,30.23 57.35,30.02 58.29,30.02 U1.K7 | R11.1 51.56,33.4 v52.07,33.4
  Bottom 0.127: v56.9,31.88 56.64,32.13 56.26,32.13 56.01,32.38 56.01,34.39 55.88,34.52 55.63,34.52 55.5,34.39 55.5,32.77 55.24,32.51 52.58,32.51 52.32,32.77 52.32,33.27 52.2,33.4 v52.07,33.4
CPU-REF  (via drill 0.25, 0.4)
  Top 0.127: v47.52,24.69 U7.H3 | v45.92,35.09 U7.Y5 | U7.H4 v46.72,24.69 | v43.52,35.89 U7.AA8
  Top 0.254: v49.72,24.32 49.72,23.81 50.16,23.37 53.47,23.37 C59.2
  Top 0.508: R3.1 R4.2
  Top 0.61: R3.1 C2.2 C13.2 R6.2 C59.2